# EAGLE schematic MSP-EXP432P401R (EAGLE 6.5.0)

## Sheet 1 of 7
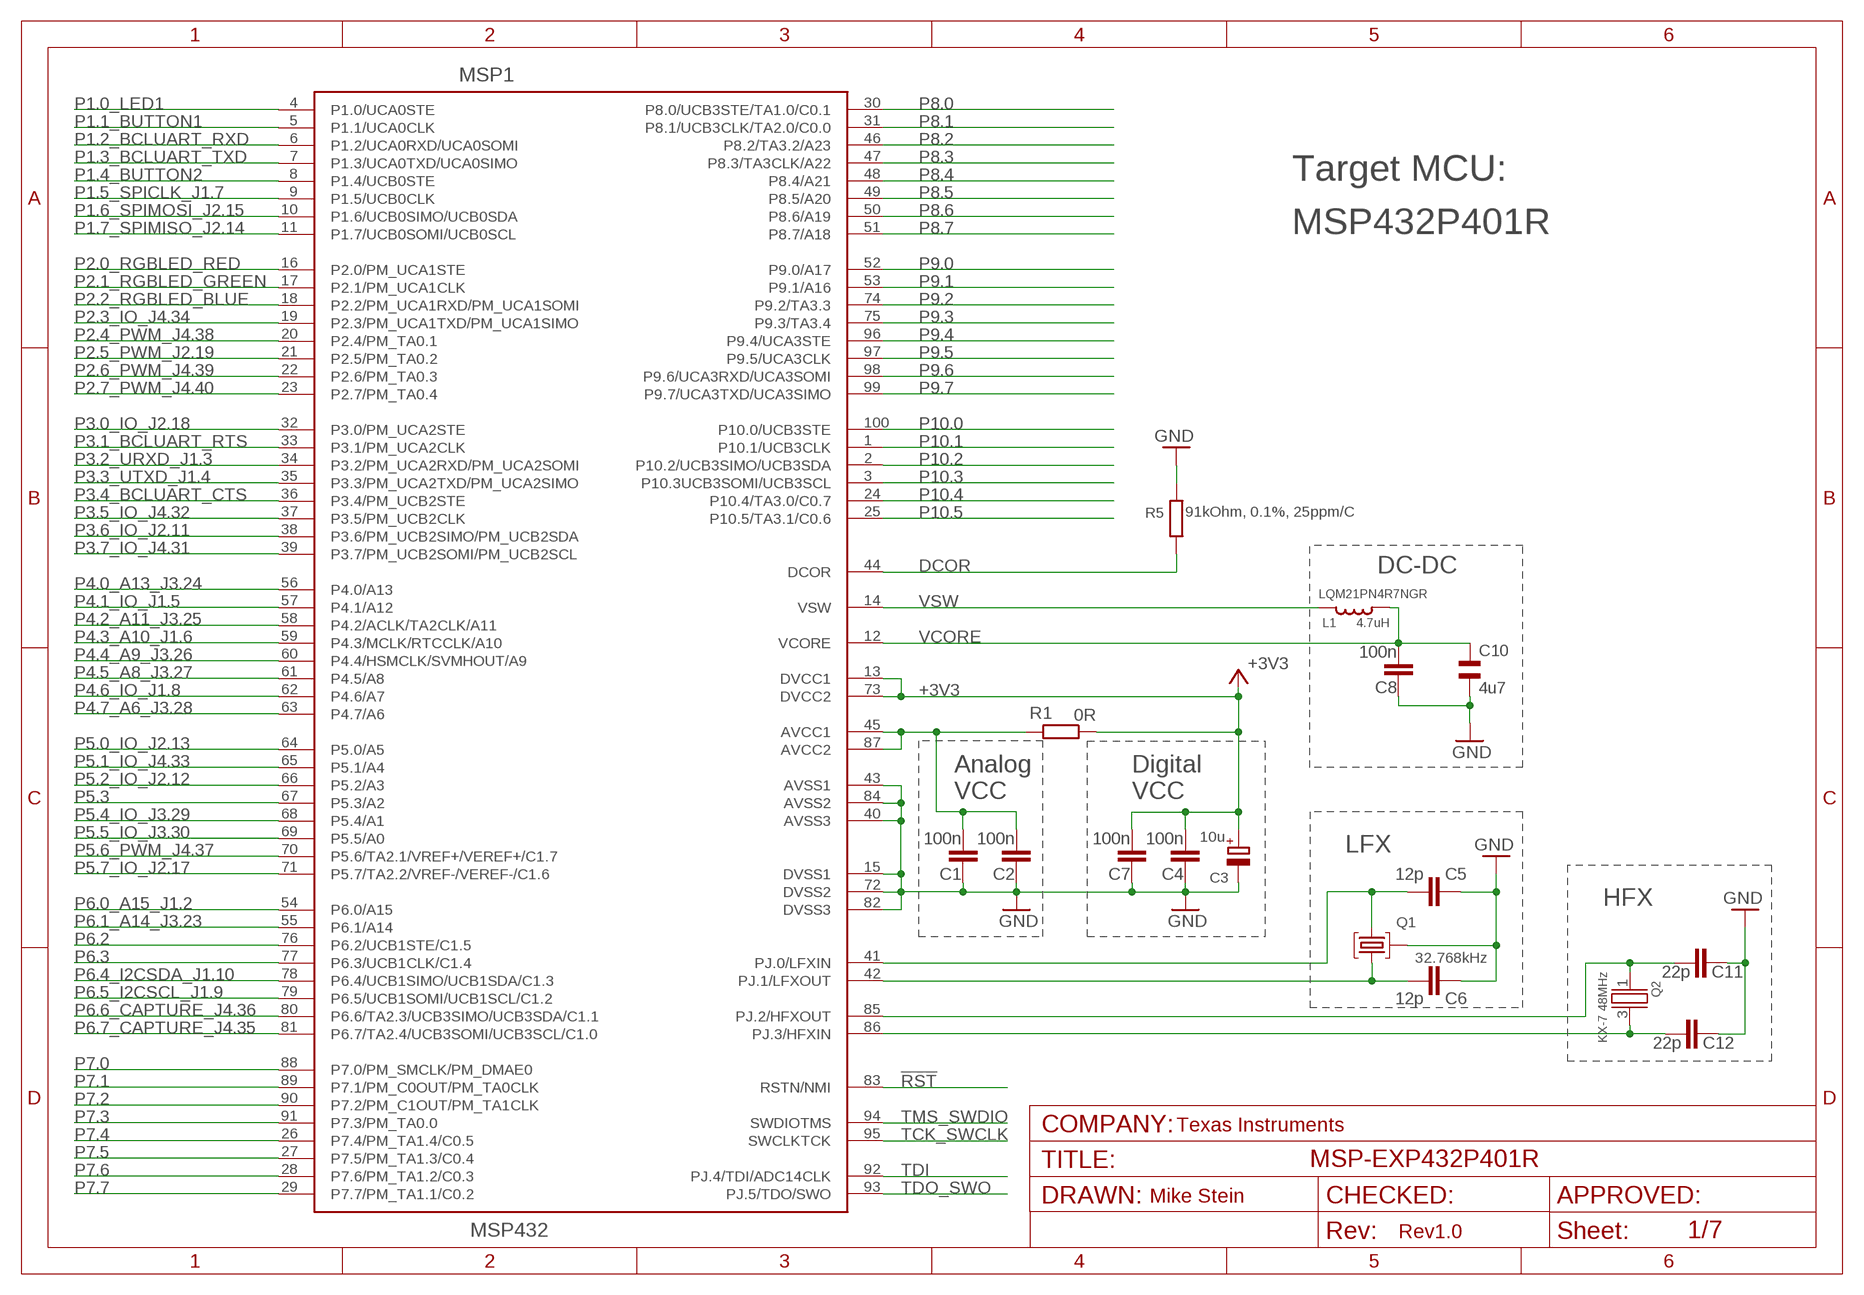
[diagram p0: schematic, sheet 1]

### Parts
C1  100n  C-EUCM0402  [0402]
C2  100n  C-EUCM0402  [0402]
C3  10u  CPOL-EUA/3216-18R  [A/3216-18R]
C4  100n  C-EUCM0402  [0402]
C5  12p  C-EUCM0402  [0402]
C6  12p  C-EUCM0402  [0402]
C7  100n  C-EUCM0402  [0402]
C8  100n  C-EUCM0402  [0402]
C10  4u7  CSMD0805  [CSMD0805]
C11  22p  C-EUCM0402  [0402]
C12  22p  C-EUCM0402  [0402]
L1  4.7uH  LQM2MP_G0  [0806]
MSP1  MSP432  [PZ100]
Q1  32.768kHz  MS3V-T1R  [MS3V-T1R]
Q2  KX-7 48MHz  KX-7  [KX-7]
R1  0R  R-EU_RM0402  [0402]
R5  91kOhm, 0.1%, 25ppm/C  R_0805  [0805]

### Nets
!RST: MSP1.83(RSTN/NMI) ; also sheet 2,3,7
+3V3: C3.+ C4.1 C7.1 MSP1.13(DVCC1) MSP1.73(DVCC2) R1.1 ; also sheet 2,3,7
DCOR: MSP1.44(DCOR) R5.1
GND: C1.2 C2.2 C3.- C4.2 C5.2 C6.2 C7.2 C8.2 C10.2 C11.2 C12.2 MSP1.15(DVSS1) MSP1.40(AVSS3) MSP1.43(AVSS1) MSP1.72(DVSS2) MSP1.82(DVSS3) MSP1.84(AVSS2) Q1.P3(GND) R5.2 ; also sheet 2,3,4,5,6,7
N$6: C1.1 C2.1 MSP1.45(AVCC1) MSP1.87(AVCC2) R1.2
N$34: C6.1 MSP1.42(PJ.1/LFXOUT) Q1.P1
N$38: C5.1 MSP1.41(PJ.0/LFXIN) Q1.P2
P1.0_LED1: MSP1.4(P1.0/UCA0STE) ; also sheet 2
P1.1_BUTTON1: MSP1.5(P1.1/UCA0CLK) ; also sheet 2
P1.2_BCLUART_RXD: MSP1.6(P1.2/UCA0RXD/UCA0SOMI) ; also sheet 3
P1.3_BCLUART_TXD: MSP1.7(P1.3/UCA0TXD/UCA0SIMO) ; also sheet 3
P1.4_BUTTON2: MSP1.8(P1.4/UCB0STE) ; also sheet 2
P1.5_SPICLK_J1.7: MSP1.9(P1.5/UCB0CLK) ; also sheet 3
P1.6_SPIMOSI_J2.15: MSP1.10(P1.6/UCB0SIMO/UCB0SDA) ; also sheet 3
P1.7_SPIMISO_J2.14: MSP1.11(P1.7/UCB0SOMI/UCB0SCL) ; also sheet 3
P2.0_RGBLED_RED: MSP1.16(P2.0/PM_UCA1STE) ; also sheet 2
P2.1_RGBLED_GREEN: MSP1.17(P2.1/PM_UCA1CLK) ; also sheet 2
P2.2_RGBLED_BLUE: MSP1.18(P2.2/PM_UCA1RXD/PM_UCA1SOMI) ; also sheet 2
P2.3_IO_J4.34: MSP1.19(P2.3/PM_UCA1TXD/PM_UCA1SIMO) ; also sheet 3
P2.4_PWM_J4.38: MSP1.20(P2.4/PM_TA0.1) ; also sheet 3
P2.5_PWM_J2.19: MSP1.21(P2.5/PM_TA0.2) ; also sheet 3
P2.6_PWM_J4.39: MSP1.22(P2.6/PM_TA0.3) ; also sheet 3
P2.7_PWM_J4.40: MSP1.23(P2.7/PM_TA0.4) ; also sheet 3
P3.0_IO_J2.18: MSP1.32(P3.0/PM_UCA2STE) ; also sheet 3
P3.1_BCLUART_RTS: MSP1.33(P3.1/PM_UCA2CLK) ; also sheet 3
P3.2_URXD_J1.3: MSP1.34(P3.2/PM_UCA2RXD/PM_UCA2SOMI) ; also sheet 3
P3.3_UTXD_J1.4: MSP1.35(P3.3/PM_UCA2TXD/PM_UCA2SIMO) ; also sheet 3
P3.4_BCLUART_CTS: MSP1.36(P3.4/PM_UCB2STE) ; also sheet 3
P3.5_IO_J4.32: MSP1.37(P3.5/PM_UCB2CLK) ; also sheet 3
P3.6_IO_J2.11: MSP1.38(P3.6/PM_UCB2SIMO/PM_UCB2SDA) ; also sheet 3
P3.7_IO_J4.31: MSP1.39(P3.7/PM_UCB2SOMI/PM_UCB2SCL) ; also sheet 3
P4.0_A13_J3.24: MSP1.56(P4.0/A13) ; also sheet 3
P4.1_IO_J1.5: MSP1.57(P4.1/A12) ; also sheet 3
P4.2_A11_J3.25: MSP1.58(P4.2/ACLK/TA2CLK/A11) ; also sheet 3
P4.3_A10_J1.6: MSP1.59(P4.3/MCLK/RTCCLK/A10) ; also sheet 3
P4.4_A9_J3.26: MSP1.60(P4.4/HSMCLK/SVMHOUT/A9) ; also sheet 3
P4.5_A8_J3.27: MSP1.61(P4.5/A8) ; also sheet 3
P4.6_IO_J1.8: MSP1.62(P4.6/A7) ; also sheet 3
P4.7_A6_J3.28: MSP1.63(P4.7/A6) ; also sheet 3
P5.0_IO_J2.13: MSP1.64(P5.0/A5) ; also sheet 3
P5.1_IO_J4.33: MSP1.65(P5.1/A4) ; also sheet 3
P5.2/XT2IN: C12.1 MSP1.86(PJ.3/HFXIN) Q2.3
P5.2_IO_J2.12: MSP1.66(P5.2/A3) ; also sheet 3
P5.3: MSP1.67(P5.3/A2) ; also sheet 3
P5.3/XT2OUT: C11.1 MSP1.85(PJ.2/HFXOUT) Q2.1
P5.4_IO_J3.29: MSP1.68(P5.4/A1) ; also sheet 3
P5.5_IO_J3.30: MSP1.69(P5.5/A0) ; also sheet 3
P5.6_PWM_J4.37: MSP1.70(P5.6/TA2.1/VREF+/VEREF+/C1.7) ; also sheet 3
P5.7_IO_J2.17: MSP1.71(P5.7/TA2.2/VREF-/VEREF-/C1.6) ; also sheet 3
P6.0_A15_J1.2: MSP1.54(P6.0/A15) ; also sheet 3
P6.1_A14_J3.23: MSP1.55(P6.1/A14) ; also sheet 3
P6.2: MSP1.76(P6.2/UCB1STE/C1.5) ; also sheet 3
P6.3: MSP1.77(P6.3/UCB1CLK/C1.4) ; also sheet 3
P6.4_I2CSDA_J1.10: MSP1.78(P6.4/UCB1SIMO/UCB1SDA/C1.3) ; also sheet 3
P6.5_I2CSCL_J1.9: MSP1.79(P6.5/UCB1SOMI/UCB1SCL/C1.2) ; also sheet 3
P6.6_CAPTURE_J4.36: MSP1.80(P6.6/TA2.3/UCB3SIMO/UCB3SDA/C1.1) ; also sheet 3
P6.7_CAPTURE_J4.35: MSP1.81(P6.7/TA2.4/UCB3SOMI/UCB3SCL/C1.0) ; also sheet 3
P7.0: MSP1.88(P7.0/PM_SMCLK/PM_DMAE0) ; also sheet 3
P7.1: MSP1.89(P7.1/PM_C0OUT/PM_TA0CLK) ; also sheet 3
P7.2: MSP1.90(P7.2/PM_C1OUT/PM_TA1CLK) ; also sheet 3
P7.3: MSP1.91(P7.3/PM_TA0.0) ; also sheet 3
P7.4: MSP1.26(P7.4/PM_TA1.4/C0.5) ; also sheet 3
P7.5: MSP1.27(P7.5/PM_TA1.3/C0.4) ; also sheet 3
P7.6: MSP1.28(P7.6/PM_TA1.2/C0.3) ; also sheet 3
P7.7: MSP1.29(P7.7/PM_TA1.1/C0.2) ; also sheet 3
P8.0: MSP1.30(P8.0/UCB3STE/TA1.0/C0.1) ; also sheet 3
P8.1: MSP1.31(P8.1/UCB3CLK/TA2.0/C0.0)
P8.2: MSP1.46(P8.2/TA3.2/A23) ; also sheet 3
P8.3: MSP1.47(P8.3/TA3CLK/A22) ; also sheet 3
P8.4: MSP1.48(P8.4/A21) ; also sheet 3
P8.5: MSP1.49(P8.5/A20) ; also sheet 3
P8.6: MSP1.50(P8.6/A19) ; also sheet 3
P8.7: MSP1.51(P8.7/A18) ; also sheet 3
P9.0: MSP1.52(P9.0/A17) ; also sheet 3
P9.1: MSP1.53(P9.1/A16) ; also sheet 3
P9.2: MSP1.74(P9.2/TA3.3) ; also sheet 3
P9.3: MSP1.75(P9.3/TA3.4) ; also sheet 3
P9.4: MSP1.96(P9.4/UCA3STE) ; also sheet 3
P9.5: MSP1.97(P9.5/UCA3CLK) ; also sheet 3
P9.6: MSP1.98(P9.6/UCA3RXD/UCA3SOMI) ; also sheet 3
P9.7: MSP1.99(P9.7/UCA3TXD/UCA3SIMO) ; also sheet 3
P10.0: MSP1.100(P10.0/UCB3STE) ; also sheet 3
P10.1: MSP1.1(P10.1/UCB3CLK) ; also sheet 3
P10.2: MSP1.2(P10.2/UCB3SIMO/UCB3SDA) ; also sheet 3
P10.3: MSP1.3(P10.3UCB3SOMI/UCB3SCL) ; also sheet 3
P10.4: MSP1.24(P10.4/TA3.0/C0.7) ; also sheet 3
P10.5: MSP1.25(P10.5/TA3.1/C0.6) ; also sheet 3
TCK_SWCLK: MSP1.95(SWCLKTCK) ; also sheet 7
TDI: MSP1.92(PJ.4/TDI/ADC14CLK) ; also sheet 7
TDO_SWO: MSP1.93(PJ.5/TDO/SWO) ; also sheet 7
TMS_SWDIO: MSP1.94(SWDIOTMS) ; also sheet 7
VCORE: C8.1 C10.1 L1.1 MSP1.12(VCORE)
VSW: L1.2 MSP1.14(VSW)

### Notes on the sheet
- Target MCU:
- MSP432P401R
- DC-DC
- LQM21PN4R7NGR
- Analog | Digital
- VCC | VCC
- LFX
- HFX
- Texas Instruments
- Mike Stein
- Rev1.0

## Sheet 2 of 7
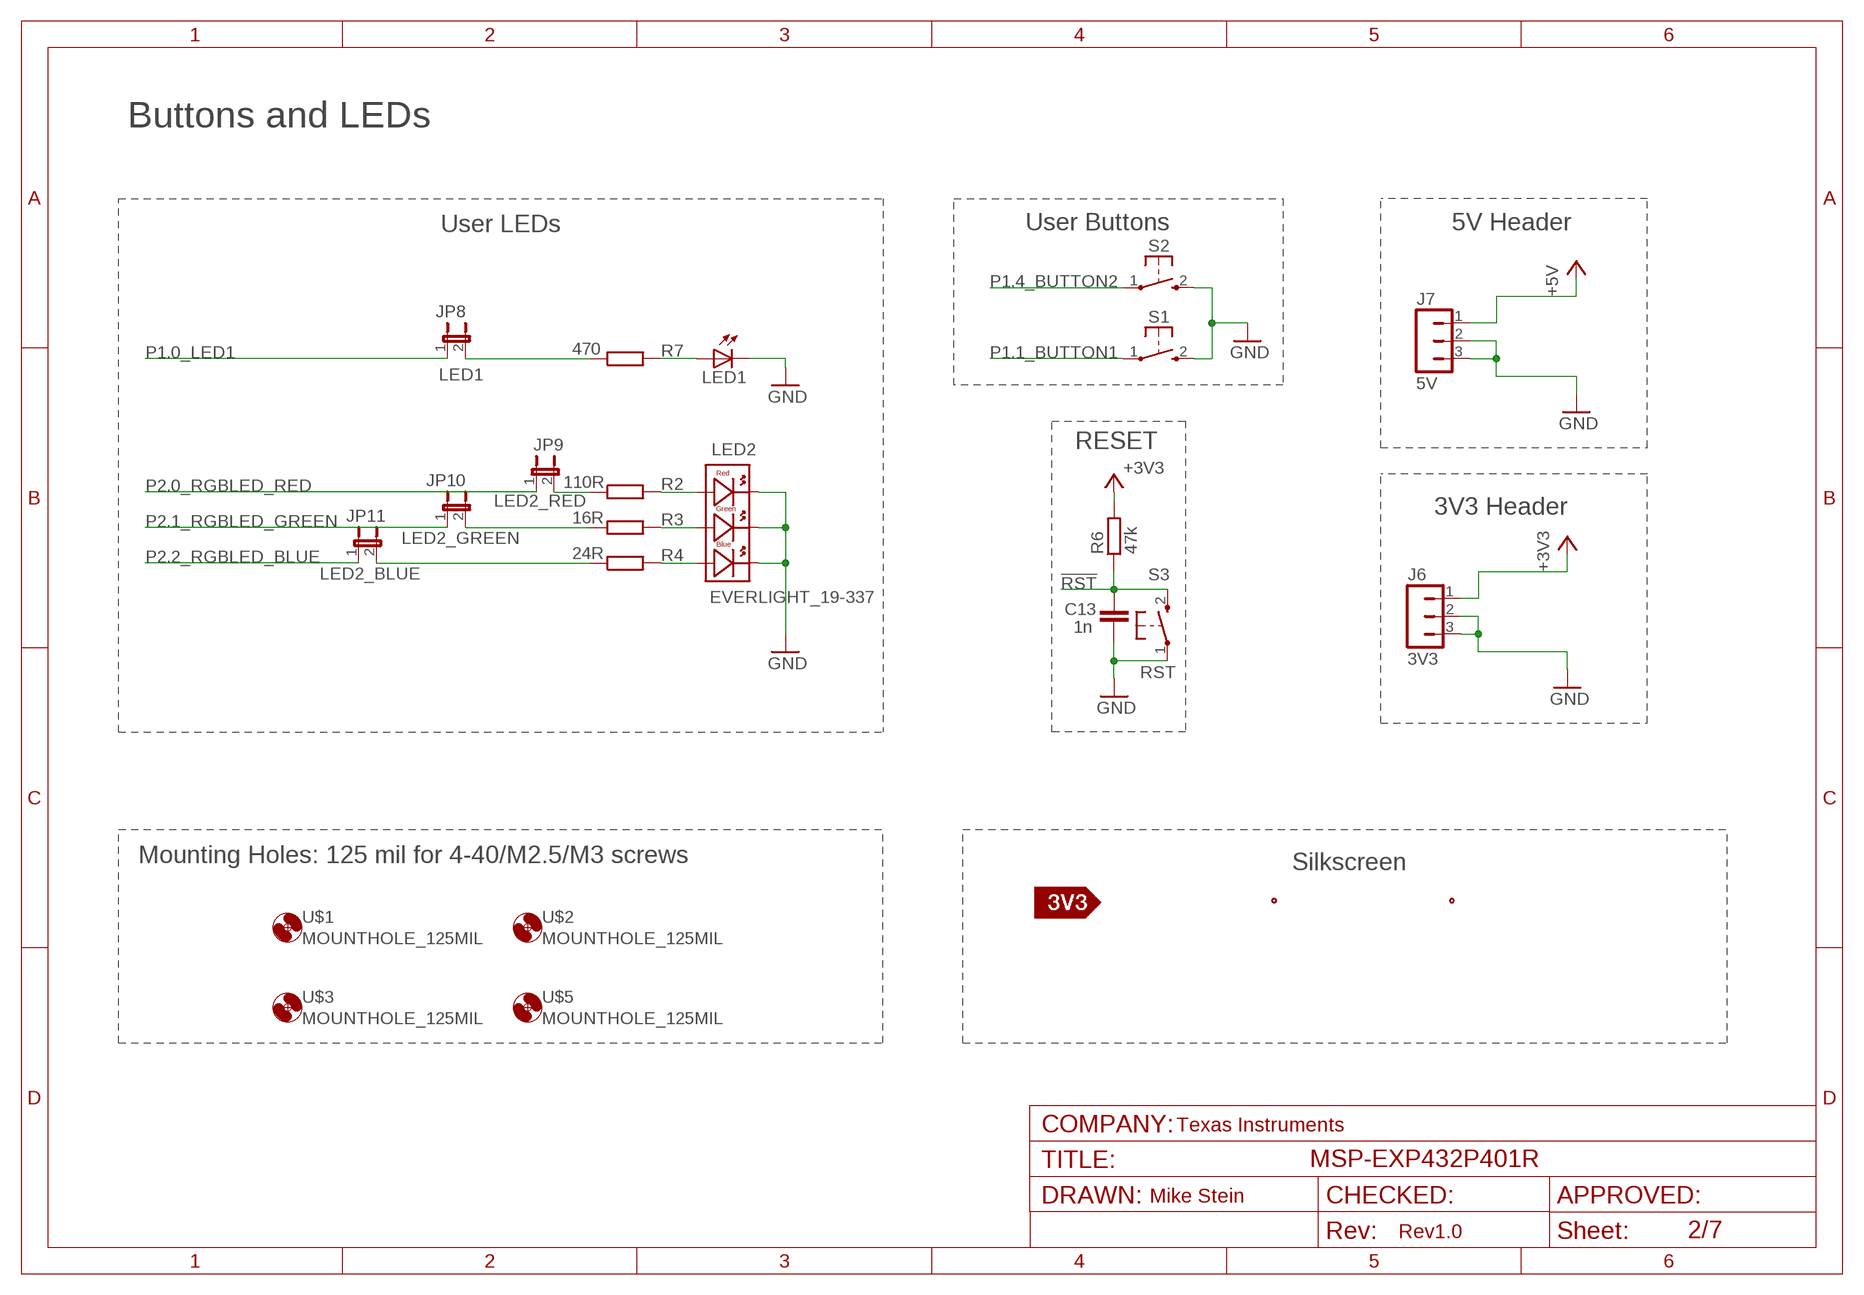
[diagram p1: schematic, sheet 2]

### Parts
C13  1n  C-EUCM0402  [0402]
J6  3V3  JP3  [JP3]
J7  5V  JP3  [JP3]
JP8  LED1  JP1M  [JP1M]
JP9  LED2_RED  JP1M  [JP1M]
JP10  LED2_GREEN  JP1M  [JP1M]
JP11  LED2_BLUE  JP1M  [JP1M]
LED1  LEDCHIPLED_0603  [CHIPLED_0603]
LED2  EVERLIGHT_19-337  [RGB_LED]
R2  110R  R-EU_RM0402  [0402]
R3  16R  R-EU_RM0402  [0402]
R4  24R  R-EU_RM0402  [0402]
R6  47k  R-EU_RM0402  [0402]
R7  470  R-EU_RM0402  [0402]
S1  PB  [PBTH]
S2  PB  [PBTH]
S3  RST  PB  [PBTH]
U$1  MOUNTHOLE_125MIL  [MOUNTHOLE_125MIL]
U$2  MOUNTHOLE_125MIL  [MOUNTHOLE_125MIL]
U$3  MOUNTHOLE_125MIL  [MOUNTHOLE_125MIL]
U$5  MOUNTHOLE_125MIL  [MOUNTHOLE_125MIL]
U$6  SILK_HEADER_LABEL  [SILK_HEADER_LABEL]
U$7  SILK_3V3_TAG  [SILK_3V3_TAG]
U$8  SILK_P401R_REAR  [SILK_P401R_REAR]

### Nets
!RST: C13.1 R6.1 S3.2(S) ; also sheet 1,3,7
+3V3: J6.1 R6.2 ; also sheet 1,3,7
+5V [Power]: J7.1 ; also sheet 3
GND: C13.2 J6.2 J6.3 J7.2 J7.3 LED1.C LED2.1(BC) LED2.2(RC) LED2.3(GC) S1.2(S) S2.2(S) S3.1(P) ; also sheet 1,3,4,5,6,7
N$8: JP9.2 R2.1
N$9: LED2.5(RA) R2.2
N$10: LED2.6(GA) R3.2
N$11: LED2.4(BA) R4.2
N$17: LED1.A R7.2
N$19: JP10.2 R3.1
N$25: JP11.2 R4.1
N$29: JP8.2 R7.1
P1.0_LED1: JP8.1 ; also sheet 1
P1.1_BUTTON1: S1.1(P) ; also sheet 1
P1.4_BUTTON2: S2.1(P) ; also sheet 1
P2.0_RGBLED_RED: JP9.1 ; also sheet 1
P2.1_RGBLED_GREEN: JP10.1 ; also sheet 1
P2.2_RGBLED_BLUE: JP11.1 ; also sheet 1

### Notes on the sheet
- Buttons and LEDs
- User LEDs | User Buttons | 5V Header
- RESET
- 3V3 Header
- Mounting Holes: 125 mil for 4-40/M2.5/M3 screws | Silkscreen
- Texas Instruments
- Mike Stein
- Rev1.0

## Sheet 3 of 7
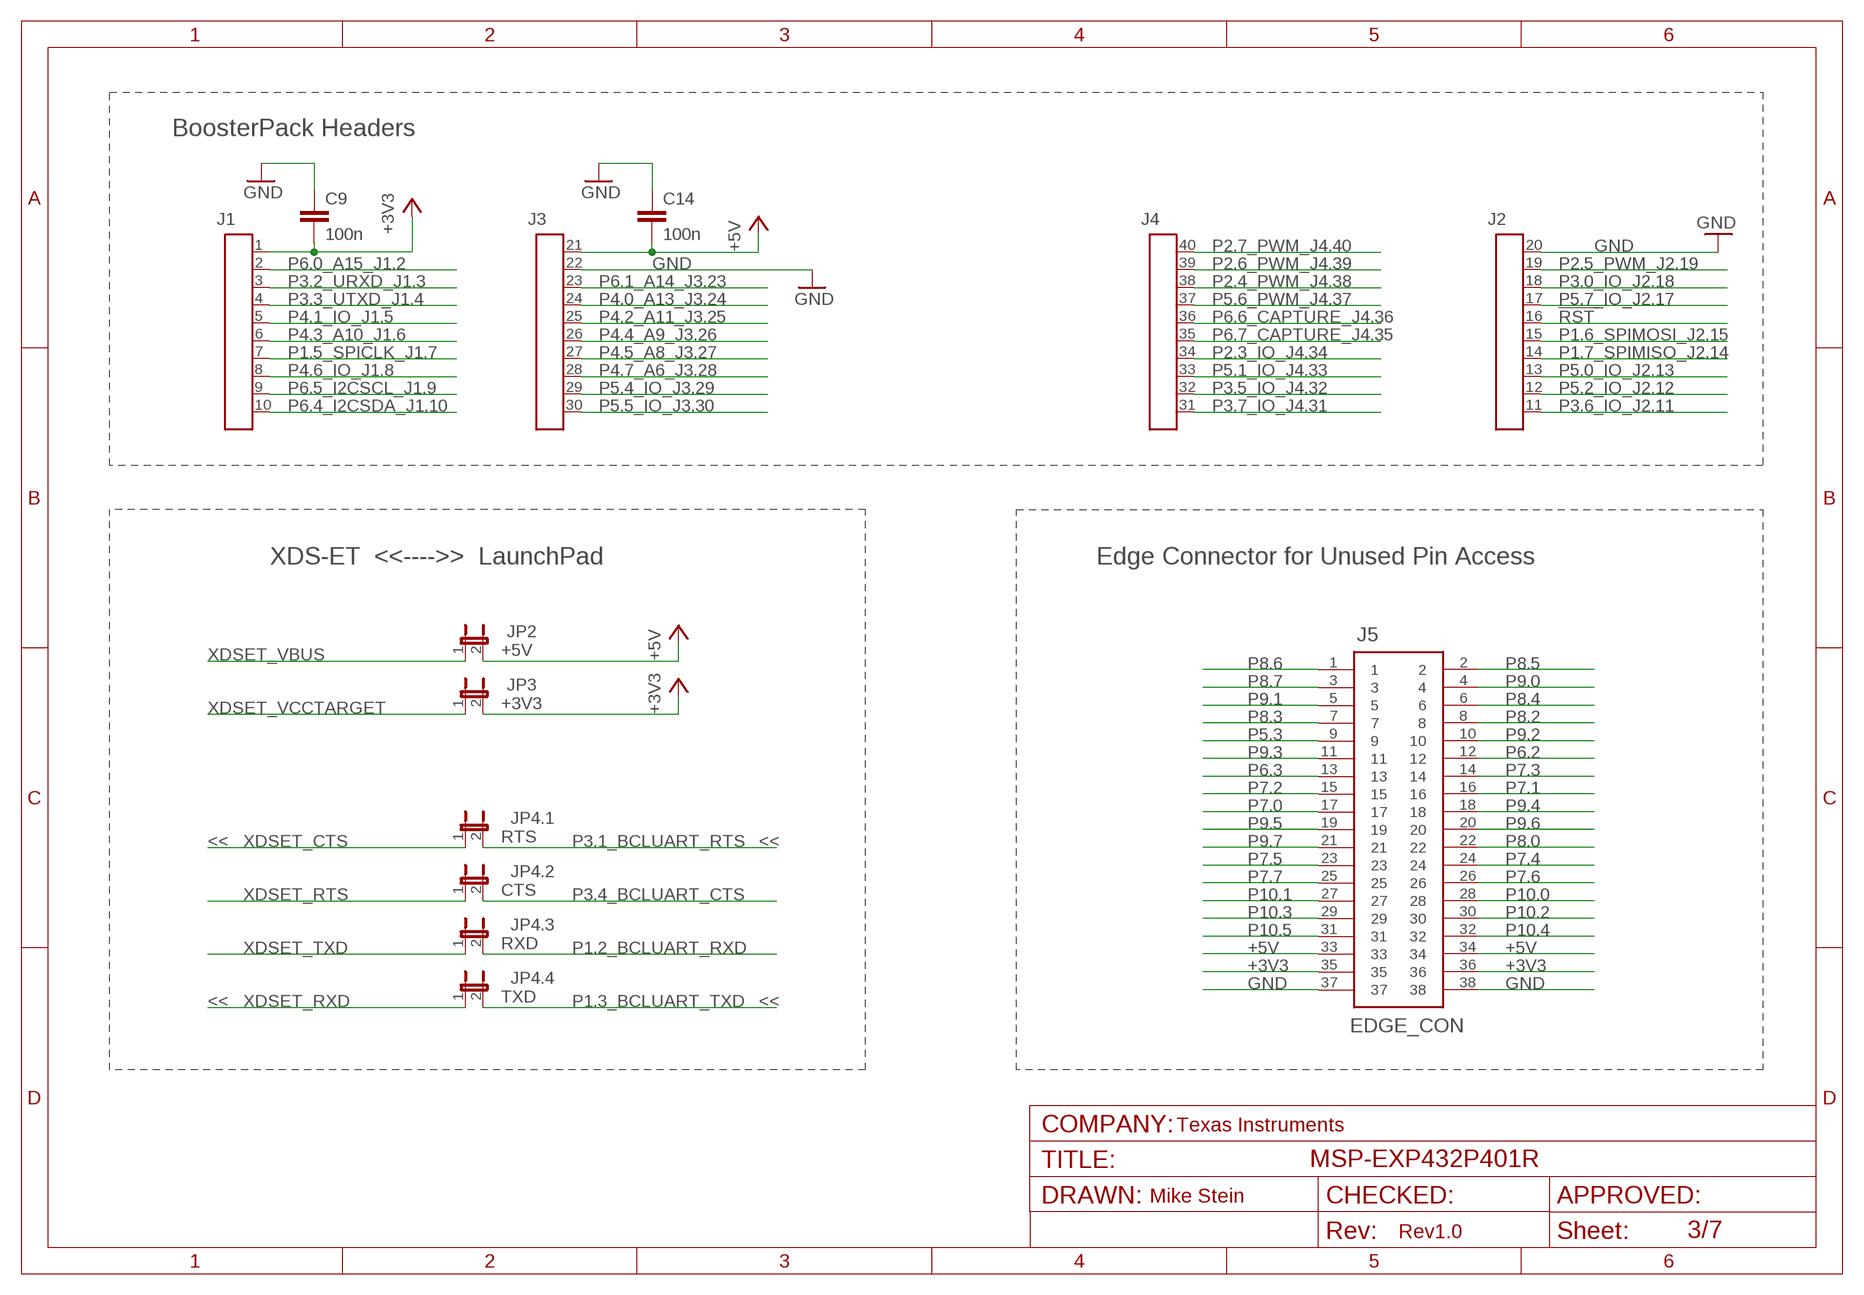
[diagram p2: schematic, sheet 3]

### Parts
C9  100n  C-EUCM0402  [0402]
C14  100n  C-EUCM0402  [0402]
J1  HEADER1X10  [1X10]
J2  HEADER1X10-J2  [1X10-J2]
J3  HEADER1X10-J3  [1X10-J3]
J4  HEADER1X10-J4  [1X10-J4]
J5  EDGE_CON  [BOTTOM_CONNECTOR]
JP2  +5V  JP1M  [JP1M]
JP3  +3V3  JP1M  [JP1M]
JP4.1  RTS  JP1M  [JP1M]
JP4.2  CTS  JP1M  [JP1M]
JP4.3  RXD  JP1M  [JP1M]
JP4.4  TXD  JP1M  [JP1M]

### Nets
!RST: J2.16 ; also sheet 1,2,7
+3V3: C9.2 J1.1 J5.35 J5.36 JP3.2 ; also sheet 1,2,7
+5V [Power]: C14.2 J3.21 J5.33 J5.34 JP2.2 ; also sheet 2
GND: C9.1 C14.1 J2.20 J3.22 J5.37 J5.38 ; also sheet 1,2,4,5,6,7
P1.2_BCLUART_RXD: JP4.3.2 ; also sheet 1
P1.3_BCLUART_TXD: JP4.4.2 ; also sheet 1
P1.5_SPICLK_J1.7: J1.7 ; also sheet 1
P1.6_SPIMOSI_J2.15: J2.15 ; also sheet 1
P1.7_SPIMISO_J2.14: J2.14 ; also sheet 1
P2.3_IO_J4.34: J4.34 ; also sheet 1
P2.4_PWM_J4.38: J4.38 ; also sheet 1
P2.5_PWM_J2.19: J2.19 ; also sheet 1
P2.6_PWM_J4.39: J4.39 ; also sheet 1
P2.7_PWM_J4.40: J4.40 ; also sheet 1
P3.0_IO_J2.18: J2.18 ; also sheet 1
P3.1_BCLUART_RTS: JP4.1.2 ; also sheet 1
P3.2_URXD_J1.3: J1.3 ; also sheet 1
P3.3_UTXD_J1.4: J1.4 ; also sheet 1
P3.4_BCLUART_CTS: JP4.2.2 ; also sheet 1
P3.5_IO_J4.32: J4.32 ; also sheet 1
P3.6_IO_J2.11: J2.11 ; also sheet 1
P3.7_IO_J4.31: J4.31 ; also sheet 1
P4.0_A13_J3.24: J3.24 ; also sheet 1
P4.1_IO_J1.5: J1.5 ; also sheet 1
P4.2_A11_J3.25: J3.25 ; also sheet 1
P4.3_A10_J1.6: J1.6 ; also sheet 1
P4.4_A9_J3.26: J3.26 ; also sheet 1
P4.5_A8_J3.27: J3.27 ; also sheet 1
P4.6_IO_J1.8: J1.8 ; also sheet 1
P4.7_A6_J3.28: J3.28 ; also sheet 1
P5.0_IO_J2.13: J2.13 ; also sheet 1
P5.1_IO_J4.33: J4.33 ; also sheet 1
P5.2_IO_J2.12: J2.12 ; also sheet 1
P5.3: J5.9 ; also sheet 1
P5.4_IO_J3.29: J3.29 ; also sheet 1
P5.5_IO_J3.30: J3.30 ; also sheet 1
P5.6_PWM_J4.37: J4.37 ; also sheet 1
P5.7_IO_J2.17: J2.17 ; also sheet 1
P6.0_A15_J1.2: J1.2 ; also sheet 1
P6.1_A14_J3.23: J3.23 ; also sheet 1
P6.2: J5.12 ; also sheet 1
P6.3: J5.13 ; also sheet 1
P6.4_I2CSDA_J1.10: J1.10 ; also sheet 1
P6.5_I2CSCL_J1.9: J1.9 ; also sheet 1
P6.6_CAPTURE_J4.36: J4.36 ; also sheet 1
P6.7_CAPTURE_J4.35: J4.35 ; also sheet 1
P7.0: J5.17 ; also sheet 1
P7.1: J5.16 ; also sheet 1
P7.2: J5.15 ; also sheet 1
P7.3: J5.14 ; also sheet 1
P7.4: J5.24 ; also sheet 1
P7.5: J5.23 ; also sheet 1
P7.6: J5.26 ; also sheet 1
P7.7: J5.25 ; also sheet 1
P8.0: J5.22 ; also sheet 1
P8.2: J5.8 ; also sheet 1
P8.3: J5.7 ; also sheet 1
P8.4: J5.6 ; also sheet 1
P8.5: J5.2 ; also sheet 1
P8.6: J5.1 ; also sheet 1
P8.7: J5.3 ; also sheet 1
P9.0: J5.4 ; also sheet 1
P9.1: J5.5 ; also sheet 1
P9.2: J5.10 ; also sheet 1
P9.3: J5.11 ; also sheet 1
P9.4: J5.18 ; also sheet 1
P9.5: J5.19 ; also sheet 1
P9.6: J5.20 ; also sheet 1
P9.7: J5.21 ; also sheet 1
P10.0: J5.28 ; also sheet 1
P10.1: J5.27 ; also sheet 1
P10.2: J5.30 ; also sheet 1
P10.3: J5.29 ; also sheet 1
P10.4: J5.32 ; also sheet 1
P10.5: J5.31 ; also sheet 1
XDSET_CTS: JP4.1.1 ; also sheet 4
XDSET_RTS: JP4.2.1 ; also sheet 4
XDSET_RXD: JP4.4.1 ; also sheet 4,7
XDSET_TXD: JP4.3.1 ; also sheet 4,7
XDSET_VBUS: JP2.1 ; also sheet 4,5,6
XDSET_VCCTARGET: JP3.1 ; also sheet 5,7

### Notes on the sheet
- BoosterPack Headers
- XDS-ET  <<---->>  LaunchPad | Edge Connector for Unused Pin Access
- << | <<
- << | <<
- Texas Instruments
- Mike Stein
- Rev1.0

## Sheet 4 of 7
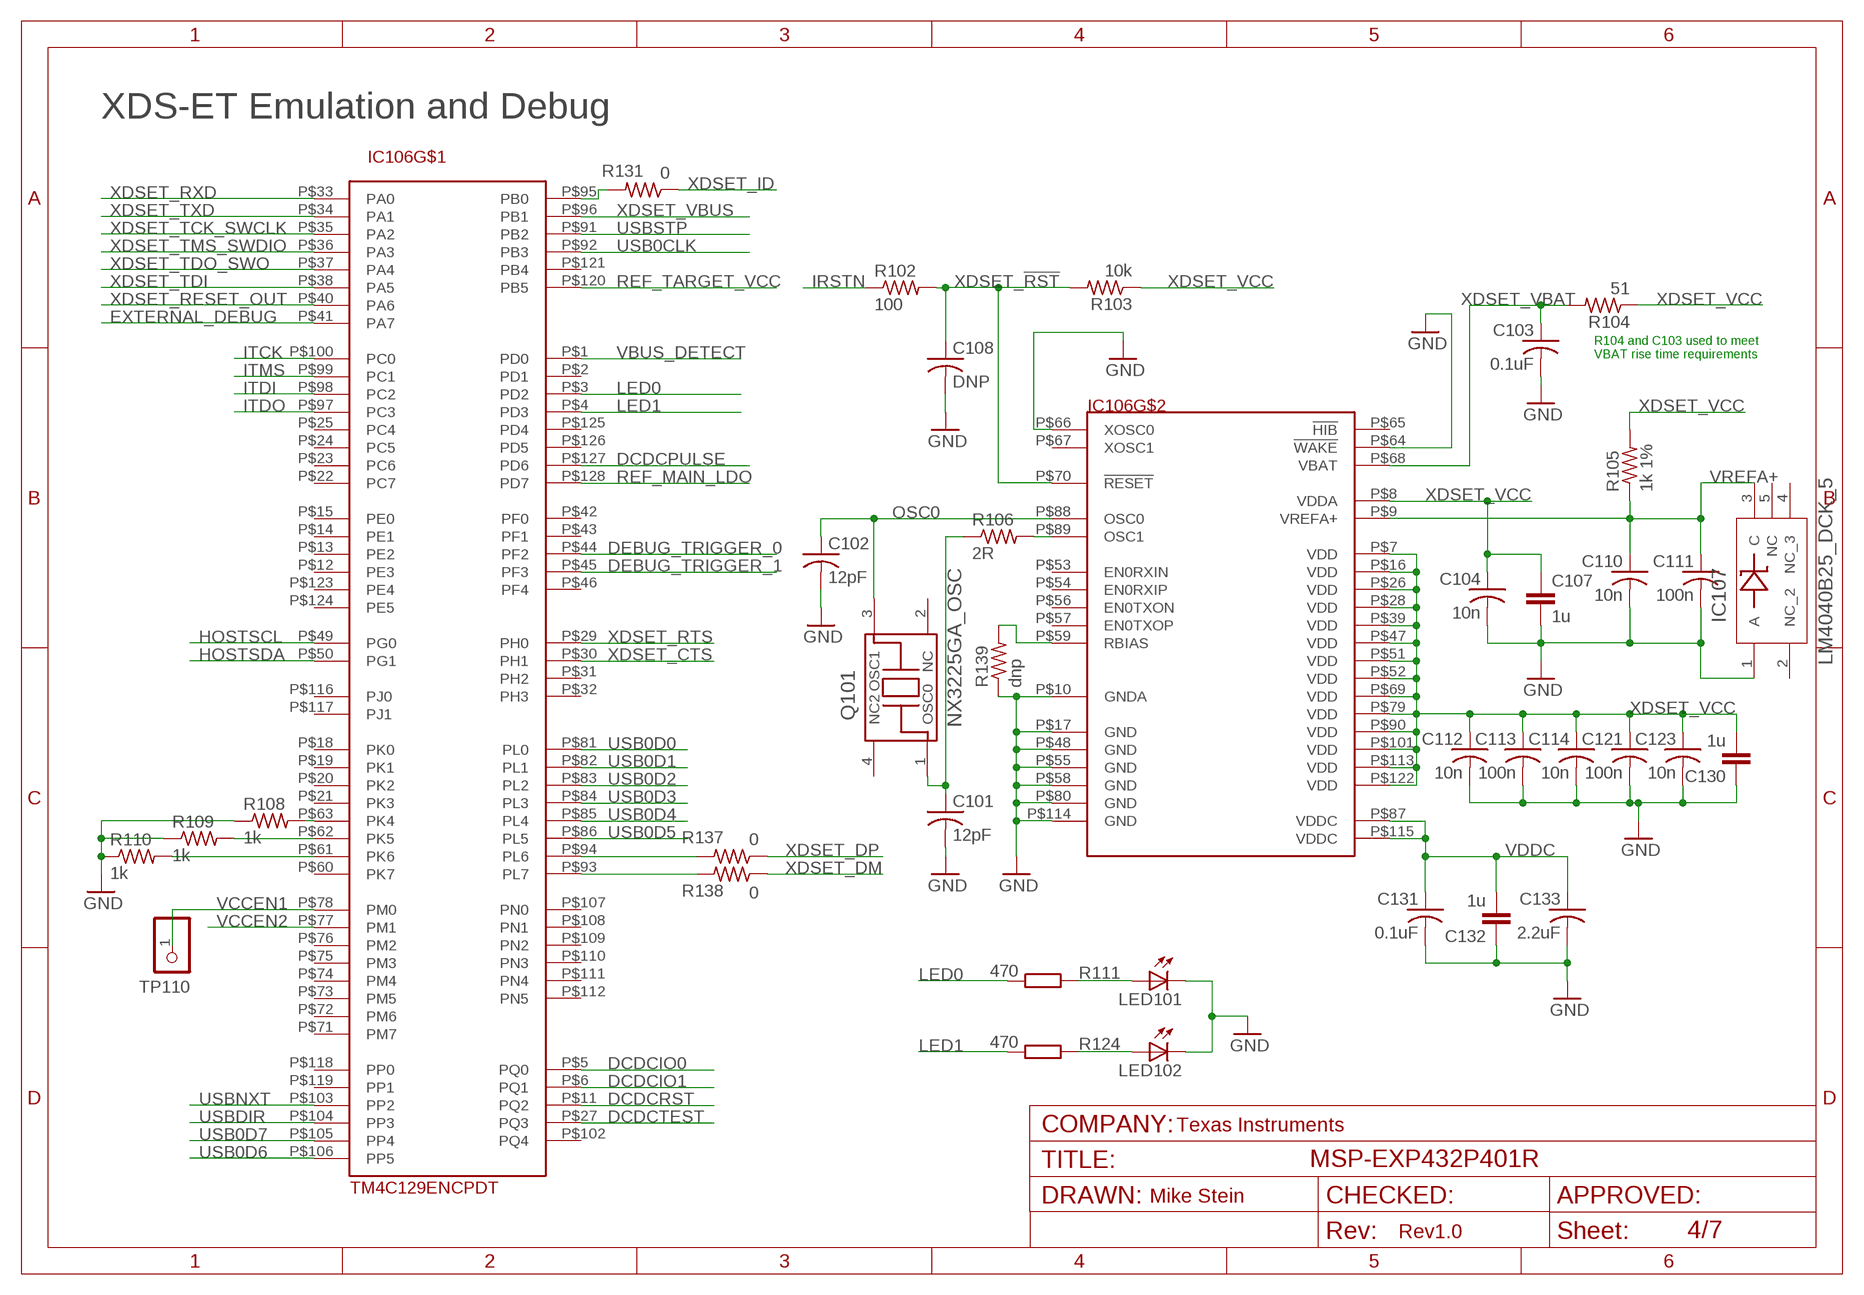
[diagram p3: schematic, sheet 4]

### Parts
C101  12pF  C-USC0402  [C0402]
C102  12pF  C-USC0402  [C0402]
C103  0.1uF  C-USC0402  [C0402]
C104  10n  C-USC0402  [C0402]
C107  1u  C-EUC0603  [C0603]
C108  DNP  C-USC0402  [C0402]
C110  10n  C-USC0402  [C0402]
C111  100n  C-USC0402  [C0402]
C112  10n  C-USC0402  [C0402]
C113  100n  C-USC0402  [C0402]
C114  10n  C-USC0402  [C0402]
C121  100n  C-USC0402  [C0402]
C123  10n  C-USC0402  [C0402]
C130  1u  C-EUC0603  [C0603]
C131  0.1uF  C-USC0402  [C0402]
C132  1u  C-EUC0603  [C0603]
C133  2.2uF  C-USC0603K  [C0603K]
IC106  TM4C129ENCPDT  [TQFP-128]
IC107  LM4040B25_DCK_5  [DCK5]
LED101  LEDCHIPLED_0603  [CHIPLED_0603]
LED102  LEDCHIPLED_0603  [CHIPLED_0603]
Q101  NX3225GA_OSC  [NX3225GA]
R102  100  R-US_R0402  [R0402]
R103  10k  R-US_R0402  [R0402]
R104  51  R-US_R0402  [R0402]
R105  1k 1%  R-US_R0402  [R0402]
R106  2R  R-US_R0402  [R0402]
R108  1k  R-US_R0402  [R0402]
R109  1k  R-US_R0402  [R0402]
R110  1k  R-US_R0402  [R0402]
R111  470  R-EU_RM0402  [0402]
R124  470  R-EU_RM0402  [0402]
R131  0  R-US_R0402  [R0402]
R137  0  R-US_R0402  [R0402]
R138  0  R-US_R0402  [R0402]
R139  dnp  R-US_R0402  [R0402]
TP110  TEST_PIN2  PINHD-1X1  [1X01]

### Nets
DCDCIO0: IC106.P$5(PQ0) ; also sheet 5
DCDCIO1: IC106.P$6(PQ1) ; also sheet 5
DCDCPULSE: IC106.P$127(PD6) ; also sheet 5
DCDCRST: IC106.P$11(PQ2) ; also sheet 5,6
DCDCTEST: IC106.P$27(PQ3) ; also sheet 5,6
DEBUG_TRIGGER_0: IC106.P$44(PF2)
DEBUG_TRIGGER_1: IC106.P$45(PF3)
EXTERNAL_DEBUG: IC106.P$41(PA7)
GND: C101.2 C102.2 C103.2 C104.2 C107.2 C108.2 C110.2 C111.2 C112.2 C113.2 C114.2 C121.2 C123.2 C130.1 C131.2 C132.1 C133.2 IC106.P$10(GNDA) IC106.P$17(GND) IC106.P$48(GND) IC106.P$55(GND) IC106.P$58(GND) IC106.P$64(!WAKE) IC106.P$66(XOSC0) IC106.P$80(GND) IC106.P$114(GND) IC107.1(A) LED101.C LED102.C R108.1 R109.1 R110.1 R139.1 ; also sheet 1,2,3,5,6,7
HOSTSCL: IC106.P$49(PG0) ; also sheet 5
HOSTSDA: IC106.P$50(PG1) ; also sheet 5
IRSTN: R102.1 ; also sheet 6
ITCK: IC106.P$100(PC0) ; also sheet 6
ITDI: IC106.P$98(PC2) ; also sheet 6
ITDO: IC106.P$97(PC3) ; also sheet 6
ITMS: IC106.P$99(PC1) ; also sheet 6
LED0: IC106.P$3(PD2) R111.1
LED1: IC106.P$4(PD3) R124.1
N$3: IC106.P$63(PK4) R108.2
N$4: LED102.A R124.2
N$7: LED101.A R111.2
N$21: IC106.P$93(PL7) R138.2
N$22: IC106.P$61(PK6) R110.2
N$23: IC106.P$95(PB0) R131.2
N$27: IC106.P$62(PK5) R109.2
N$47: IC106.P$59(RBIAS) R139.2
OSC0: C102.1 IC106.P$88(OSC0) Q101.3(OSC1)
OSC1: IC106.P$89(OSC1) R106.2
OSC1_R: C101.1 Q101.1(OSC0) R106.1
REF_MAIN_LDO: IC106.P$128(PD7) ; also sheet 5
REF_TARGET_VCC: IC106.P$120(PB5) ; also sheet 5
USB0CLK: IC106.P$92(PB3) ; also sheet 7
USB0D0: IC106.P$81(PL0) ; also sheet 7
USB0D1: IC106.P$82(PL1) ; also sheet 7
USB0D2: IC106.P$83(PL2) ; also sheet 7
USB0D3: IC106.P$84(PL3) ; also sheet 7
USB0D4: IC106.P$85(PL4) ; also sheet 7
USB0D5: IC106.P$86(PL5) ; also sheet 7
USB0D6: IC106.P$106(PP5) ; also sheet 7
USB0D7: IC106.P$105(PP4) ; also sheet 7
USBDIR: IC106.P$104(PP3) ; also sheet 7
USBNXT: IC106.P$103(PP2) ; also sheet 7
USBSTP: IC106.P$91(PB2) ; also sheet 7
VBUS_DETECT: IC106.P$1(PD0) ; also sheet 6
VCCEN1: IC106.P$78(PM0) TP110.1 ; also sheet 5
VCCEN2: IC106.P$77(PM1)
VDDC: C131.1 C132.2 C133.1 IC106.P$87(VDDC) IC106.P$115(VDDC)
VREFA+: C110.1 C111.1 IC106.P$9(VREFA+) IC107.3(C) R105.1
XDSET_!RST: C108.1 IC106.P$70(!RESET) R102.2 R103.2
XDSET_CTS: IC106.P$30(PH1) ; also sheet 3
XDSET_DM: R138.1 ; also sheet 6
XDSET_DP: R137.1 ; also sheet 6
XDSET_DPR: IC106.P$94(PL6) R137.2
XDSET_ID: R131.1 ; also sheet 6
XDSET_RESET_OUT: IC106.P$40(PA6) ; also sheet 7
XDSET_RTS: IC106.P$29(PH0) ; also sheet 3
XDSET_RXD: IC106.P$33(PA0) ; also sheet 3,7
XDSET_TCK_SWCLK: IC106.P$35(PA2) ; also sheet 7
XDSET_TDI: IC106.P$38(PA5) ; also sheet 7
XDSET_TDO_SWO: IC106.P$37(PA4) ; also sheet 7
XDSET_TMS_SWDIO: IC106.P$36(PA3) ; also sheet 7
XDSET_TXD: IC106.P$34(PA1) ; also sheet 3,7
XDSET_VBAT: C103.1 IC106.P$68(VBAT) R104.2
XDSET_VBUS: IC106.P$96(PB1) ; also sheet 3,5,6
XDSET_VCC: C104.1 C107.1 C112.1 C113.1 C114.1 C121.1 C123.1 C130.2 IC106.P$7(VDD) IC106.P$8(VDDA) IC106.P$16(VDD) IC106.P$26(VDD) IC106.P$28(VDD) IC106.P$39(VDD) IC106.P$47(VDD) IC106.P$51(VDD) IC106.P$52(VDD) IC106.P$69(VDD) IC106.P$79(VDD) IC106.P$90(VDD) IC106.P$101(VDD) IC106.P$113(VDD) IC106.P$122(VDD) R103.1 R104.1 R105.2 ; also sheet 5,6,7
Unconnected: IC106.P$2(PD1) IC106.P$12(PE3) IC106.P$13(PE2) IC106.P$14(PE1) IC106.P$15(PE0) IC106.P$18(PK0) IC106.P$19(PK1) IC106.P$20(PK2) IC106.P$21(PK3) IC106.P$22(PC7) IC106.P$23(PC6) IC106.P$24(PC5) IC106.P$25(PC4) IC106.P$31(PH2) IC106.P$32(PH3) IC106.P$42(PF0) IC106.P$43(PF1) IC106.P$46(PF4) IC106.P$53(EN0RXIN) IC106.P$54(EN0RXIP) IC106.P$56(EN0TXON) IC106.P$57(EN0TXOP) IC106.P$60(PK7) IC106.P$65(!HIB) IC106.P$67(XOSC1) IC106.P$71(PM7) IC106.P$72(PM6) IC106.P$73(PM5) IC106.P$74(PM4) IC106.P$75(PM3) IC106.P$76(PM2) IC106.P$102(PQ4) IC106.P$107(PN0) IC106.P$108(PN1) IC106.P$109(PN2) IC106.P$110(PN3) IC106.P$111(PN4) IC106.P$112(PN5) IC106.P$116(PJ0) IC106.P$117(PJ1) IC106.P$118(PP0) IC106.P$119(PP1) IC106.P$121(PB4) IC106.P$123(PE4) IC106.P$124(PE5) IC106.P$125(PD4) IC106.P$126(PD5) IC107.2(NC_2) IC107.4(NC_3) IC107.5(NC) Q101.2(NC) Q101.4(NC2)

### Notes on the sheet
- XDS-ET Emulation and Debug
- R104 and C103 used to meet 
  VBAT rise time requirements
- Texas Instruments
- Mike Stein
- Rev1.0

## Sheet 5 of 7
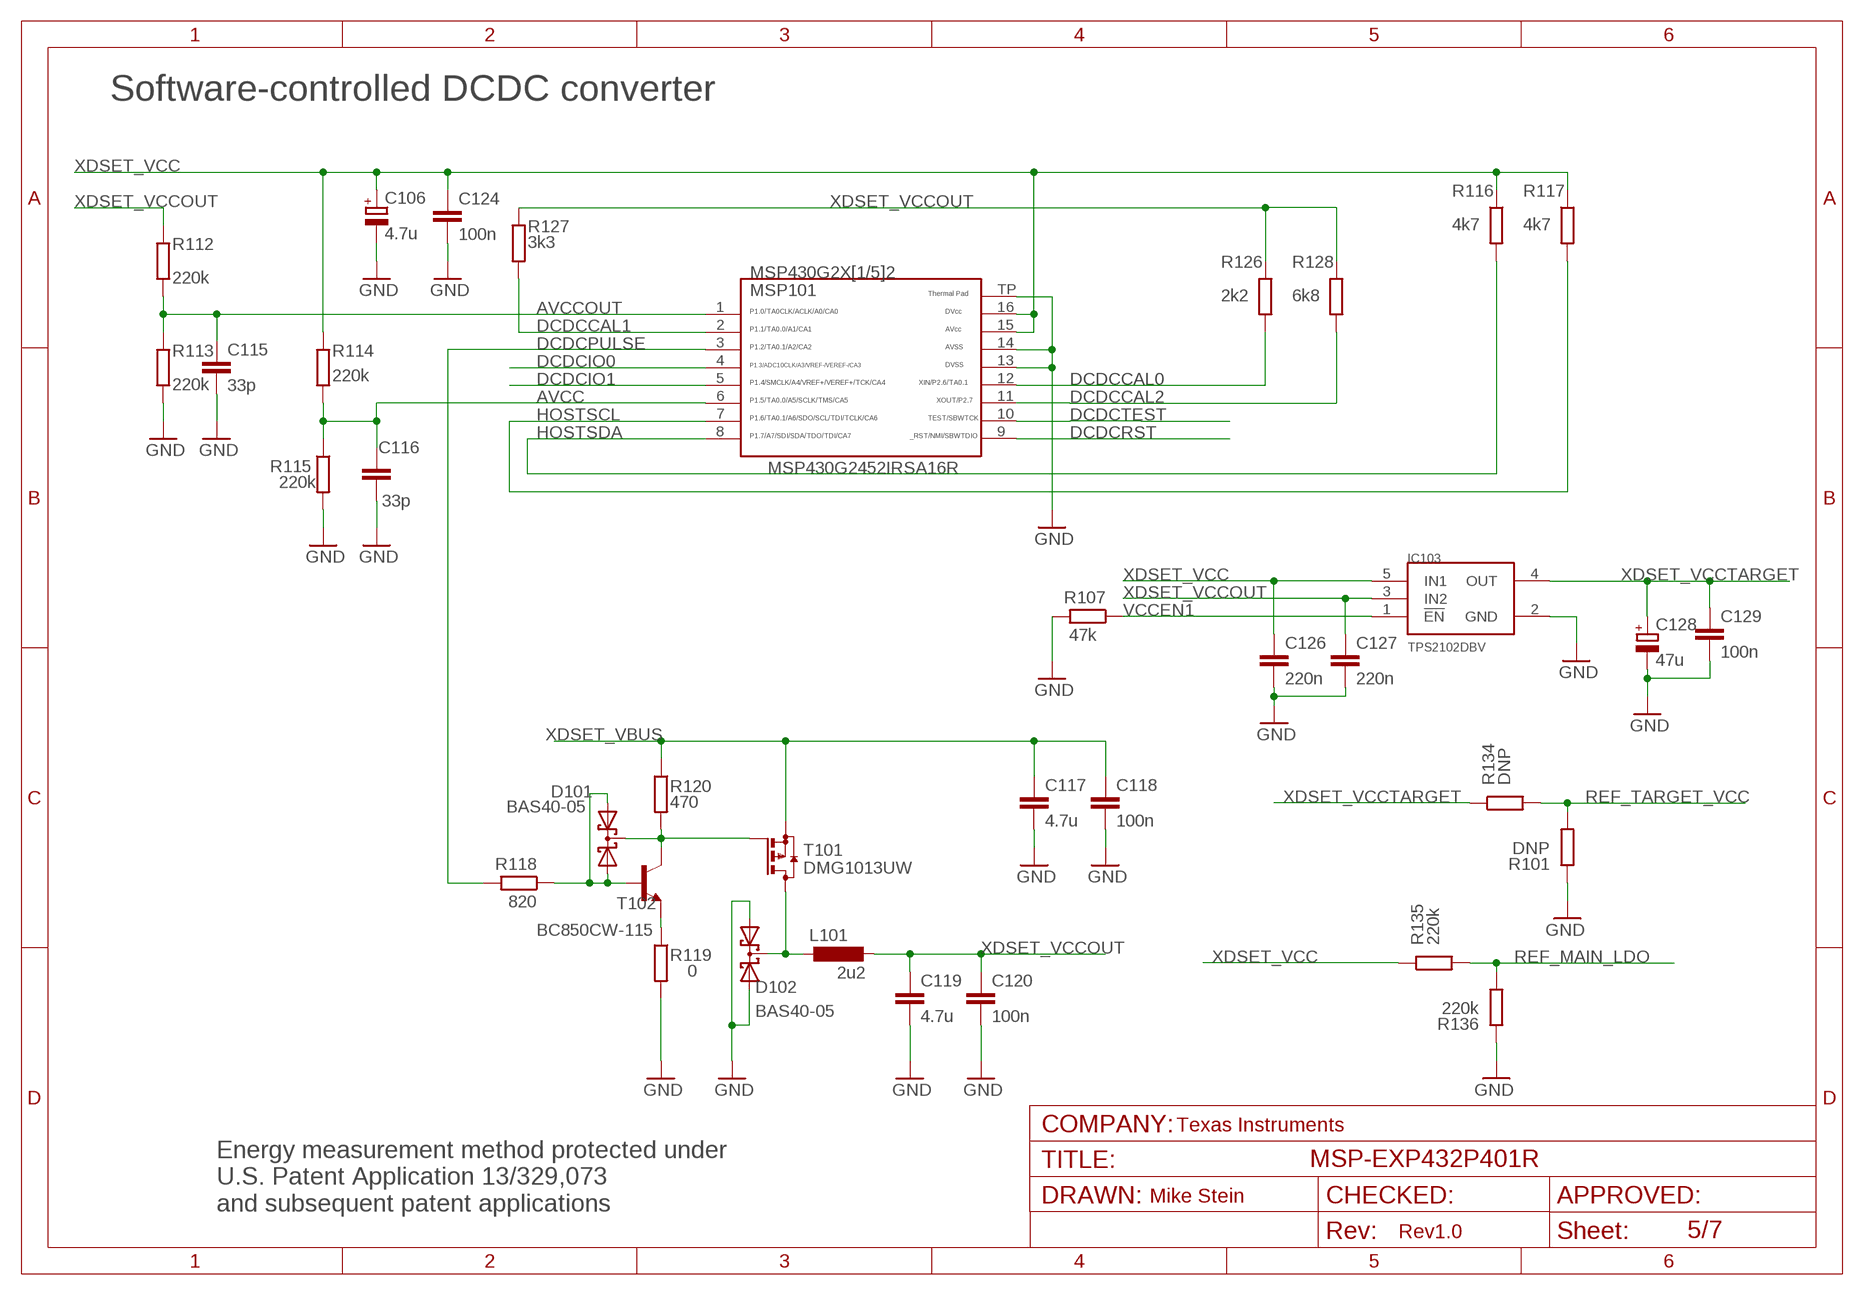
[diagram p4: schematic, sheet 5]

### Parts
C106  4.7u  CPOL-EUA/3216-18R  [A/3216-18R]
C115  33p  C-EUCM0402  [0402]
C116  33p  C-EUCM0402  [0402]
C117  4.7u  C-EUC0603  [C0603]
C118  100n  C-EUCM0402  [0402]
C119  4.7u  C-EUC0603  [C0603]
C120  100n  C-EUCM0402  [0402]
C124  100n  C-EUCM0402  [0402]
C126  220n  C-EUCM0402  [0402]
C127  220n  C-EUCM0402  [0402]
C128  47u  CPOL-EUA/3216-18R  [A/3216-18R]
C129  100n  C-EUCM0402  [0402]
D101  BAS40-05  BAS70-05  [SOT23]
D102  BAS40-05  BAS70-05  [SOT23]
IC103  TPS2102DBV  [SOT23-5]
L101  2u2  L-EUL3216C  [L3216C]
MSP101  MSP430G2452IRSA16R  G2X[1/5]2---RSA16  [RSA16]
R101  DNP  R-EU_RM0402  [0402]
R107  47k  R-EU_RM0402  [0402]
R112  220k  R-EU_RM0402  [0402]
R113  220k  R-EU_RM0402  [0402]
R114  220k  R-EU_RM0402  [0402]
R115  220k  R-EU_RM0402  [0402]
R116  4k7  R-EU_RM0402  [0402]
R117  4k7  R-EU_RM0402  [0402]
R118  820  R-EU_RM0402  [0402]
R119  0  R-EU_RM0402  [0402]
R120  470  R-EU_RM0402  [0402]
R126  2k2  R-EU_RM0402  [0402]
R127  3k3  R-EU_RM0402  [0402]
R128  6k8  R-EU_RM0402  [0402]
R134  DNP  R-EU_RM0402  [0402]
R135  220k  R-EU_RM0402  [0402]
R136  220k  R-EU_RM0402  [0402]
T101  DMG1013UW  BSS84  [SOT23]
T102  BC850CW-115  BC850SMD  [SOT23-BEC]

### Nets
AVCC: C116.2 MSP101.6 R114.2 R115.1
AVCCOUT: C115.2 MSP101.1 R112.2 R113.1
DCDCCAL0: MSP101.12 R126.2
DCDCCAL1: MSP101.2 R127.2
DCDCCAL2: MSP101.11 R128.2
DCDCIO0: MSP101.4 ; also sheet 4
DCDCIO1: MSP101.5 ; also sheet 4
DCDCPULSE: MSP101.3 R118.2 ; also sheet 4
DCDCRST: MSP101.9 ; also sheet 4,6
DCDCTEST: MSP101.10 ; also sheet 4,6
GND: C106.- C115.1 C116.1 C117.2 C118.2 C119.2 C120.2 C124.2 C126.2 C127.2 C128.- C129.2 D102.1(A1) D102.2(A2) IC103.2(GND) MSP101.13 MSP101.14 MSP101.TP R101.1 R107.2 R113.2 R115.2 R119.2 R136.1 ; also sheet 1,2,3,4,6,7
HOSTSCL: MSP101.7 R117.2 ; also sheet 4
HOSTSDA: MSP101.8 R116.2 ; also sheet 4
N$12: R119.1 T102.E
N$13: D101.1(A1) D101.2(A2) R118.1 T102.B
N$15: D102.3(C) L101.1 T101.3(D)
N$16: D101.3(C) R120.2 T101.1(G) T102.C
REF_MAIN_LDO: R135.2 R136.2 ; also sheet 4
REF_TARGET_VCC: R101.2 R134.2 ; also sheet 4
VCCEN1: IC103.1(!EN) R107.1 ; also sheet 4
XDSET_VBUS: C117.1 C118.1 R120.1 T101.2(S) ; also sheet 3,4,6
XDSET_VCC: C106.+ C124.1 C126.1 IC103.5(IN1) MSP101.15 MSP101.16 R114.1 R116.1 R117.1 R135.1 ; also sheet 4,6,7
XDSET_VCCOUT: C119.1 C120.1 C127.1 IC103.3(IN2) L101.2 R112.1 R126.1 R127.1 R128.1
XDSET_VCCTARGET: C128.+ C129.1 IC103.4(OUT) R134.1 ; also sheet 3,7

### Notes on the sheet
- Software-controlled DCDC converter
- MSP430G2452IRSA16R
- Texas Instruments
- Mike Stein
- Energy measurement method protected under 
  U.S. Patent Application 13/329,073 
  and subsequent patent applications
- Rev1.0

## Sheet 6 of 7
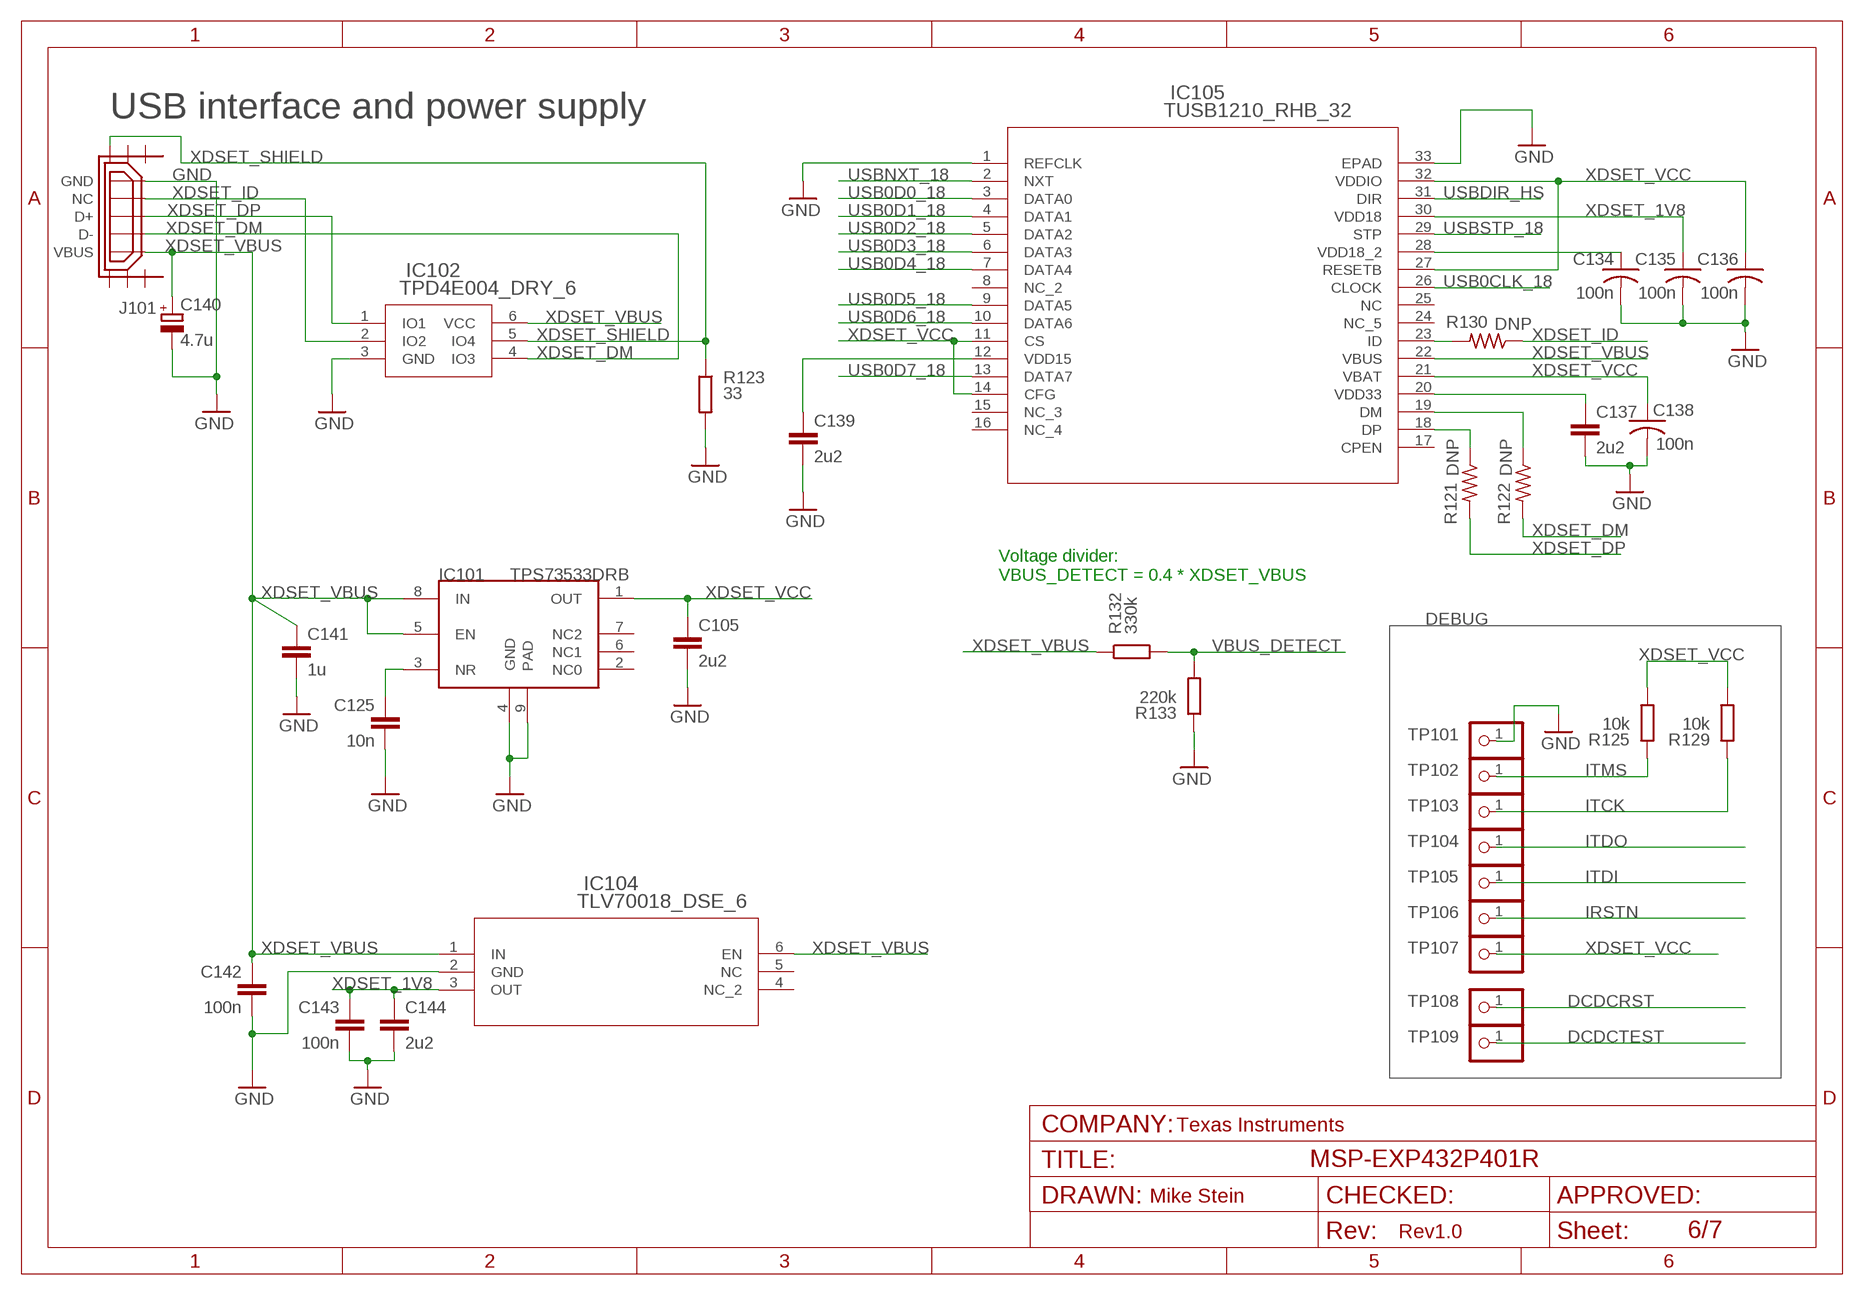
[diagram p5: schematic, sheet 6]

### Parts
C105  2u2  C-EUC0603  [C0603]
C125  10n  C-EUCM0402  [0402]
C134  100n  C-USC0402  [C0402]
C135  100n  C-USC0402  [C0402]
C136  100n  C-USC0402  [C0402]
C137  2u2  C-EUC0603  [C0603]
C138  100n  C-USC0402  [C0402]
C139  2u2  C-EUC0603  [C0603]
C140  4.7u  CPOL-EUA/3216-18R  [A/3216-18R]
C141  1u  C-EUC0603  [C0603]
C142  100n  C-EUCM0402  [0402]
C143  100n  C-EUCM0402  [0402]
C144  2u2  C-EUC0603  [C0603]
IC101  TPS73533DRB  TPS73633DRB  [SON8]
IC102  TPD4E004_DRY_6  [DRY6]
IC104  TLV70018_DSE_6  [DSE6]
IC105  TUSB1210_RHB_32  [RHB32_3P45X3P45]
J101  USB_MICRO_FLIPPED  [HIROSE-ZX62R-B-5P]
R121  DNP  R-US_R0402  [R0402]
R122  DNP  R-US_R0402  [R0402]
R123  33  R-EU_RM0402  [0402]
R125  10k  R-EU_RM0402  [0402]
R129  10k  R-EU_RM0402  [0402]
R130  DNP  R-US_R0402  [R0402]
R132  330k  R-EU_RM0402  [0402]
R133  220k  R-EU_RM0402  [0402]
TP101  TEST_PIN2  PINHD-1X1  [1X01]
TP102  TEST_PIN2  PINHD-1X1  [1X01]
TP103  TEST_PIN2  PINHD-1X1  [1X01]
TP104  TEST_PIN2  PINHD-1X1  [1X01]
TP105  TEST_PIN2  PINHD-1X1  [1X01]
TP106  TEST_PIN2  PINHD-1X1  [1X01]
TP107  TEST_PIN2  PINHD-1X1  [1X01]
TP108  TEST_PIN2  PINHD-1X1  [1X01]
TP109  TEST_PIN2  PINHD-1X1  [1X01]

### Nets
DCDCRST: TP108.1 ; also sheet 4,5
DCDCTEST: TP109.1 ; also sheet 4,5
GND: C105.2 C125.2 C134.2 C135.2 C136.2 C137.2 C138.2 C139.2 C140.- C141.2 C142.2 C143.2 C144.2 IC101.4(GND) IC101.9(PAD) IC102.3(GND) IC104.2(GND) IC105.1(REFCLK) IC105.33(EPAD) J101.GND R123.2 R133.1 TP101.1 ; also sheet 1,2,3,4,5,7
IRSTN: TP106.1 ; also sheet 4
ITCK: R129.1 TP103.1 ; also sheet 4
ITDI: TP105.1 ; also sheet 4
ITDO: TP104.1 ; also sheet 4
ITMS: R125.1 TP102.1 ; also sheet 4
N$1: IC105.18(DP) R121.1
N$2: IC105.19(DM) R122.1
N$5: C125.1 IC101.3(NR)
N$20: C137.1 IC105.20(VDD33)
N$26: C139.1 IC105.12(VDD15)
N$28: C134.1 IC105.28(VDD18_2)
USB0CLK_18: IC105.26(CLOCK) ; also sheet 7
USB0D0_18: IC105.3(DATA0) ; also sheet 7
USB0D1_18: IC105.4(DATA1) ; also sheet 7
USB0D2_18: IC105.5(DATA2) ; also sheet 7
USB0D3_18: IC105.6(DATA3) ; also sheet 7
USB0D4_18: IC105.7(DATA4) ; also sheet 7
USB0D5_18: IC105.9(DATA5) ; also sheet 7
USB0D6_18: IC105.10(DATA6) ; also sheet 7
USB0D7_18: IC105.13(DATA7) ; also sheet 7
USBDIR_HS: IC105.31(DIR) ; also sheet 7
USBNXT_18: IC105.2(NXT) ; also sheet 7
USBSTP_18: IC105.29(STP) ; also sheet 7
VBUS_DETECT: R132.2 R133.2 ; also sheet 4
XDSET_1V8: C135.1 C143.1 C144.1 IC104.3(OUT) IC105.30(VDD18) ; also sheet 7
XDSET_DM: IC102.4(IO3) J101.D- R122.2 ; also sheet 4
XDSET_DP: IC102.1(IO1) J101.D+ R121.2 ; also sheet 4
XDSET_ID: IC102.2(IO2) J101.NC R130.1 ; also sheet 4
XDSET_IDR: IC105.23(ID) R130.2
XDSET_SHIELD: IC102.5(IO4) J101.SHIELD3 R123.1
XDSET_VBUS: C140.+ C141.1 C142.1 IC101.5(EN) IC101.8(IN) IC102.6(VCC) IC104.1(IN) IC104.6(EN) IC105.22(VBUS) J101.VBUS R132.1 ; also sheet 3,4,5
XDSET_VCC: C105.1 C136.1 C138.1 IC101.1(OUT) IC105.11(CS) IC105.14(CFG) IC105.21(VBAT) IC105.27(RESETB) IC105.32(VDDIO) R125.2 R129.2 TP107.1 ; also sheet 4,5,7
Unconnected: IC101.2(NC0) IC101.6(NC1) IC101.7(NC2) IC104.4(NC_2) IC104.5(NC) IC105.8(NC_2) IC105.15(NC_3) IC105.16(NC_4) IC105.17(CPEN) IC105.24(NC_5) IC105.25(NC) J101.SHIELD1 J101.SHIELD2 J101.SHIELD4 J101.SHIELD5 J101.SHIELD6

### Notes on the sheet
- USB interface and power supply
- Voltage divider:
  VBUS_DETECT = 0.4 * XDSET_VBUS
- DEBUG
- Texas Instruments
- Mike Stein
- Rev1.0

## Sheet 7 of 7
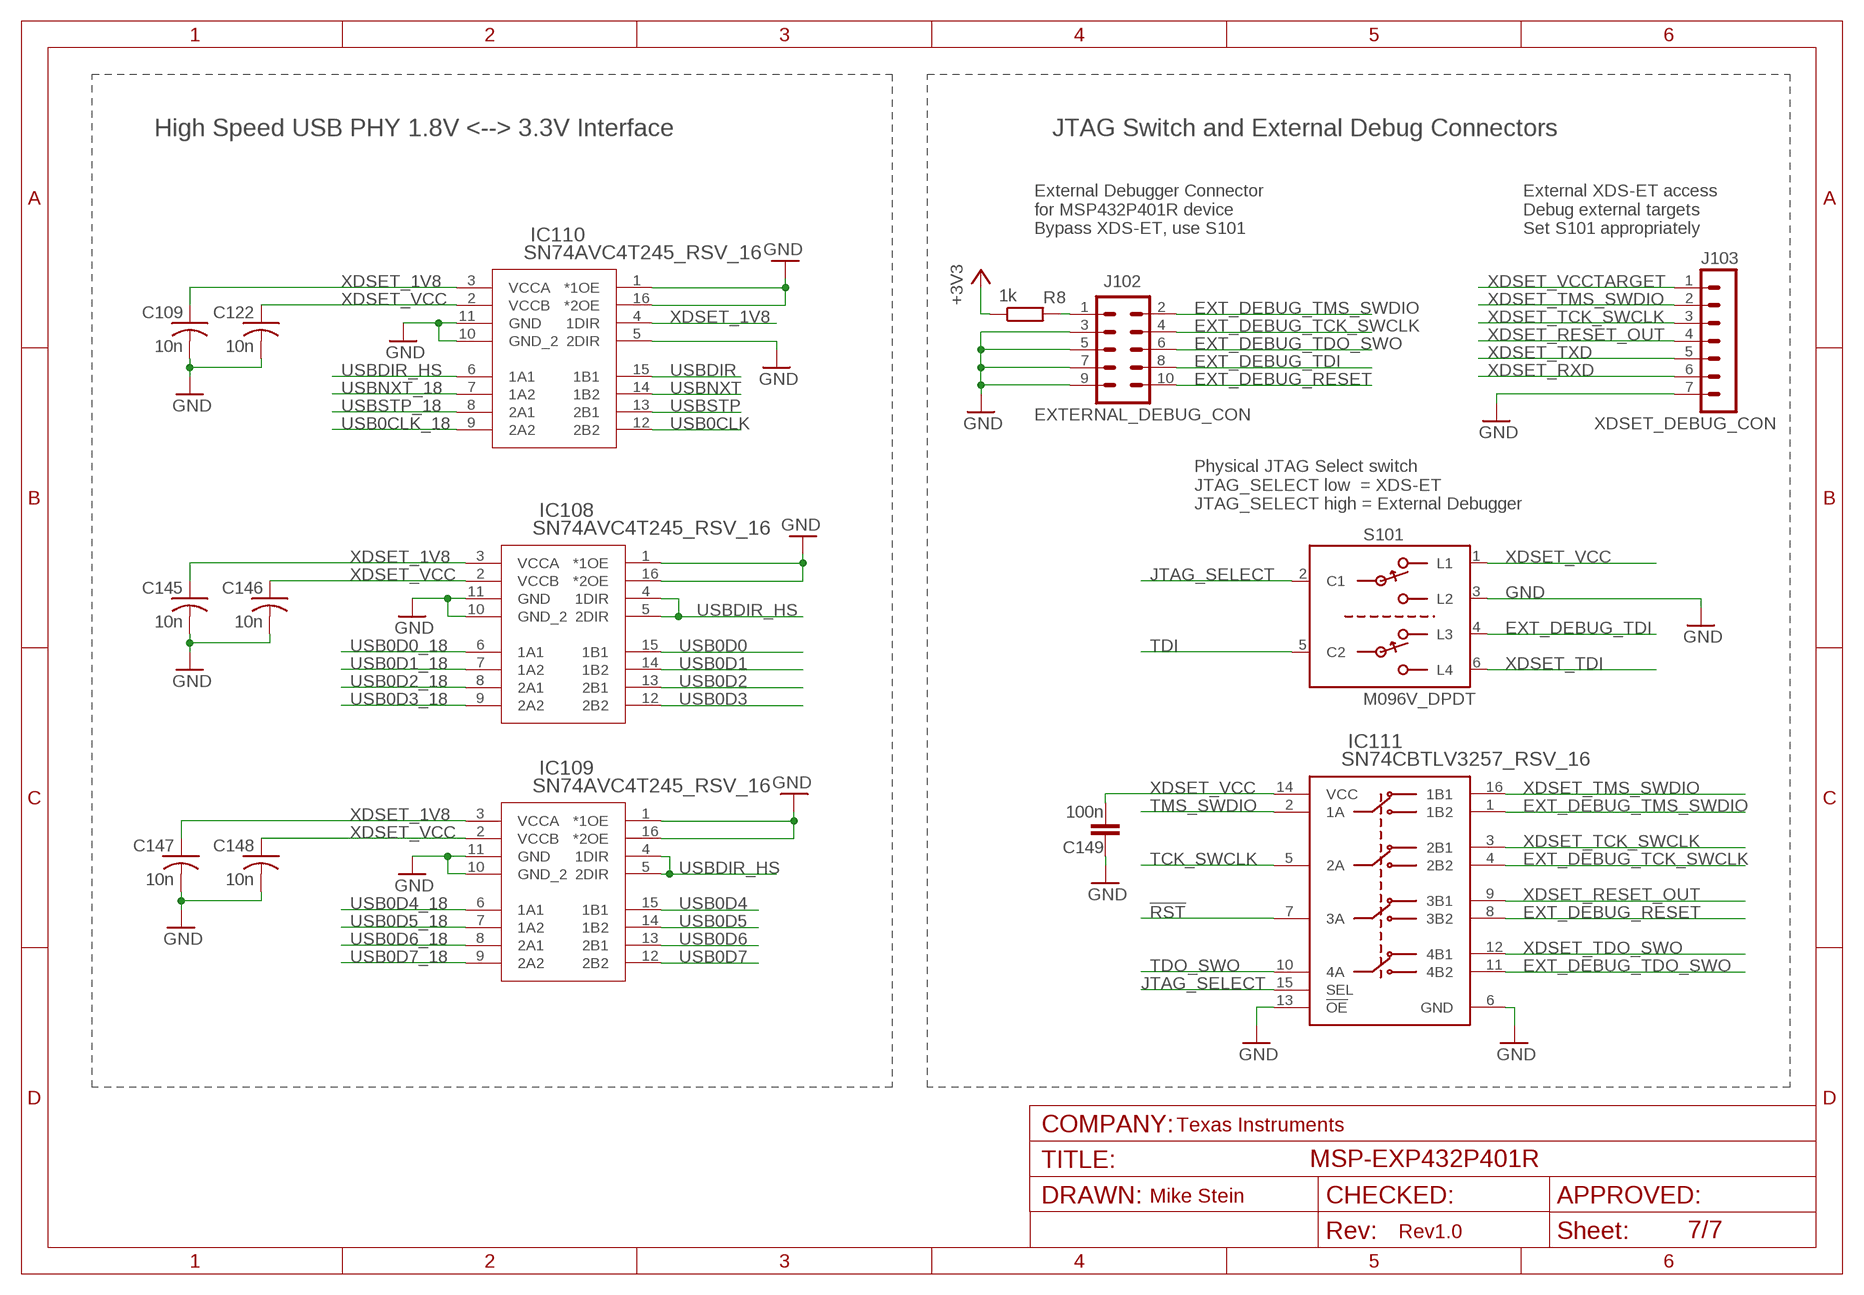
[diagram p6: schematic, sheet 7]

### Parts
C109  10n  C-USC0402  [C0402]
C122  10n  C-USC0402  [C0402]
C145  10n  C-USC0402  [C0402]
C146  10n  C-USC0402  [C0402]
C147  10n  C-USC0402  [C0402]
C148  10n  C-USC0402  [C0402]
C149  100n  C-EUCM0402  [0402]
IC108  SN74AVC4T245_RSV_16  [RSV16]
IC109  SN74AVC4T245_RSV_16  [RSV16]
IC110  SN74AVC4T245_RSV_16  [RSV16]
IC111  SN74CBTLV3257_RSV_16  [RSV16]
J102  EXTERNAL_DEBUG_CON  [EXTERNAL_DEBUG]
J103  XDSET_DEBUG_CON  [XDSET_DEBUG]
R8  1k  R-EU_RM0402  [0402]
S101  M096V_DPDT  [M096V_DPDT]

### Nets
!RST: IC111.7(3A) ; also sheet 1,2,3
+3V3: R8.1 ; also sheet 1,2,3
EXT_DEBUG_RESET: IC111.8(3B2) J102.10
EXT_DEBUG_TCK_SWCLK: IC111.4(2B2) J102.4
EXT_DEBUG_TDI: J102.8 S101.4(L3)
EXT_DEBUG_TDO_SWO: IC111.11(4B2) J102.6
EXT_DEBUG_TMS_SWDIO: IC111.1(1B2) J102.2
GND: C109.2 C122.2 C145.2 C146.2 C147.2 C148.2 C149.2 IC108.1(*1OE) IC108.10(GND_2) IC108.11(GND) IC108.16(*2OE) IC109.1(*1OE) IC109.10(GND_2) IC109.11(GND) IC109.16(*2OE) IC110.1(*1OE) IC110.5(2DIR) IC110.10(GND_2) IC110.11(GND) IC110.16(*2OE) IC111.6(GND) IC111.13(!OE) J102.3 J102.5 J102.7 J102.9 J103.7 S101.3(L2) ; also sheet 1,2,3,4,5,6
JTAG_SELECT: IC111.15(SEL) S101.2(C1)
N$14: J102.1 R8.2
TCK_SWCLK: IC111.5(2A) ; also sheet 1
TDI: S101.5(C2) ; also sheet 1
TDO_SWO: IC111.10(4A) ; also sheet 1
TMS_SWDIO: IC111.2(1A) ; also sheet 1
USB0CLK: IC110.12(2B2) ; also sheet 4
USB0CLK_18: IC110.9(2A2) ; also sheet 6
USB0D0: IC108.15(1B1) ; also sheet 4
USB0D0_18: IC108.6(1A1) ; also sheet 6
USB0D1: IC108.14(1B2) ; also sheet 4
USB0D1_18: IC108.7(1A2) ; also sheet 6
USB0D2: IC108.13(2B1) ; also sheet 4
USB0D2_18: IC108.8(2A1) ; also sheet 6
USB0D3: IC108.12(2B2) ; also sheet 4
USB0D3_18: IC108.9(2A2) ; also sheet 6
USB0D4: IC109.15(1B1) ; also sheet 4
USB0D4_18: IC109.6(1A1) ; also sheet 6
USB0D5: IC109.14(1B2) ; also sheet 4
USB0D5_18: IC109.7(1A2) ; also sheet 6
USB0D6: IC109.13(2B1) ; also sheet 4
USB0D6_18: IC109.8(2A1) ; also sheet 6
USB0D7: IC109.12(2B2) ; also sheet 4
USB0D7_18: IC109.9(2A2) ; also sheet 6
USBDIR: IC110.15(1B1) ; also sheet 4
USBDIR_HS: IC108.4(1DIR) IC108.5(2DIR) IC109.4(1DIR) IC109.5(2DIR) IC110.6(1A1) ; also sheet 6
USBNXT: IC110.14(1B2) ; also sheet 4
USBNXT_18: IC110.7(1A2) ; also sheet 6
USBSTP: IC110.13(2B1) ; also sheet 4
USBSTP_18: IC110.8(2A1) ; also sheet 6
XDSET_1V8: C109.1 C145.1 C147.1 IC108.3(VCCA) IC109.3(VCCA) IC110.3(VCCA) IC110.4(1DIR) ; also sheet 6
XDSET_RESET_OUT: IC111.9(3B1) J103.4 ; also sheet 4
XDSET_RXD: J103.6 ; also sheet 3,4
XDSET_TCK_SWCLK: IC111.3(2B1) J103.3 ; also sheet 4
XDSET_TDI: S101.6(L4) ; also sheet 4
XDSET_TDO_SWO: IC111.12(4B1) ; also sheet 4
XDSET_TMS_SWDIO: IC111.16(1B1) J103.2 ; also sheet 4
XDSET_TXD: J103.5 ; also sheet 3,4
XDSET_VCC: C122.1 C146.1 C148.1 C149.1 IC108.2(VCCB) IC109.2(VCCB) IC110.2(VCCB) IC111.14(VCC) S101.1(L1) ; also sheet 4,5,6
XDSET_VCCTARGET: J103.1 ; also sheet 3,5

### Notes on the sheet
- High Speed USB PHY 1.8V <--> 3.3V Interface | JTAG Switch and External Debug Connectors
- External Debugger Connector
  for MSP432P401R device
  Bypass XDS-ET, use S101
- External XDS-ET access
  Debug external targets
  Set S101 appropriately
- Physical JTAG Select switch
  JTAG_SELECT low  = XDS-ET
  JTAG_SELECT high = External Debugger
- Texas Instruments
- Mike Stein
- Rev1.0

## Library data of the parts
C1 C2 C4-C9 C11-C14 C105 C107 C115-C120 C124-C127 C129 C130 C132 C137 C139 C141-C144 C149 = rcl:C-EU: CAPACITOR, European symbol
C3 C106 C128 C140 = rcl:CPOL-EU: POLARIZED CAPACITOR, European symbol
C10 = cap:CSMD0805
C101 C102 = EK-TM4C129EXL:C-US: CAPACITOR, American symbol; GNUM: G10-C0402-C120-AAC
C103 C104 C108-C114 C121-C123 C131 C134-C136 C138 C145-C148 = EK-TM4C129EXL:C-US: CAPACITOR, American symbol; GNUM: G10-C0402-C104-HBA
C133 = EK-TM4C129EXL:C-US: CAPACITOR, American symbol; DIGIKEY_PARTNUM: 311-1451-2-ND; GNUM: G10-C0603-C225-HBB
D101 D102 = diode:BAS70-05: Silicon Schottky Diodes General-purpose diode for high-speed switching
IC101 = MSP430G6_LP:TPS73633DRB
IC102 = MSP-EXP432:TPD4E004_DRY_6; DATASHEETURL: http://www.ti.com/lit/gpn/TPD4E004; DESCRIPTION: 4-Channel ESD Protection Array for High-Speed Data Interfaces; FAMILY_NAME: ESD Solution; GENERIC_PART_NUMBER: TPD4E004; INDUSTRY_STD_PKG_TYPE: SON; MANUFACTURER: Texas Instruments; MANUFACTURER_PART_NUMBER: tpd4e004_dry_6; PACKAGE_DESIGNATOR: DRY; PIN_COUNT: 6; VENDOR: Texas Instruments
IC103 = MSP430G6_LP:TPS2102DBV
IC104 = MSP-EXP432:TLV70018_DSE_6; DATASHEETURL: http://www.ti.com/lit/gpn/TLV70018; DESCRIPTION: 200mA, Low IQ, Low Dropout Regulator for Portables; FAMILY_NAME: SINGLE CHANNEL LDO; GENERIC_PART_NUMBER: TLV70018; INDUSTRY_STD_PKG_TYPE: WSON; MANUFACTURER: Texas Instruments; MANUFACTURER_PART_NUMBER: tlv70018_dse_6; PACKAGE_DESIGNATOR: DSE; PIN_COUNT: 6; VENDOR: Texas Instruments
IC105 = MSP-EXP432:TUSB1210_RHB_32; DATASHEETURL: http://www.ti.com/lit/gpn/TUSB1210; DESCRIPTION: USB 2.0 ULPI Transceiver; FAMILY_NAME: USB TRANSCEIVER; GENERIC_PART_NUMBER: TUSB1210; INDUSTRY_STD_PKG_TYPE: QFN; MANUFACTURER: Texas Instruments; MANUFACTURER_PART_NUMBER: tusb1210_rhb_32; PACKAGE_DESIGNATOR: RHB; PIN_COUNT: 32; VENDOR: Texas Instruments
IC106 = EK-TM4C129EXL:TM4C129ENCPDT
IC107 = MSP-EXP432:LM4040B25_DCK_5; DATASHEETURL: http://www.ti.com/lit/gpn/LM4040B25; DESCRIPTION: 2.5-V Precision Micropower Shunt Voltage Reference, 0.2% accuracy; FAMILY_NAME: SHUNT VOLTAGE REFERENCE; GENERIC_PART_NUMBER: LM4040B25; INDUSTRY_STD_PKG_TYPE: SC70; MANUFACTURER: Texas Instruments; MANUFACTURER_PART_NUMBER: lm4040b25_dck_5; PACKAGE_DESIGNATOR: DCK; PIN_COUNT: 5; VENDOR: Texas Instruments
IC108-IC110 = MSP-EXP432:SN74AVC4T245_RSV_16; DATASHEETURL: http://www.ti.com/lit/gpn/SN74AVC4T245; DESCRIPTION: 4-Bit Dual-Supply Bus Transceiver with Configurable Voltage Translation and 3-State Outputs; FAMILY_NAME: DIRECTION CONTROL DUAL SUPPLY TRANSLATOR; GENERIC_PART_NUMBER: SN74AVC4T245; INDUSTRY_STD_PKG_TYPE: UQFN; MANUFACTURER: Texas Instruments; MANUFACTURER_PART_NUMBER: sn74avc4t245_rsv_16; PACKAGE_DESIGNATOR: RSV; PIN_COUNT: 16; VENDOR: Texas Instruments
IC111 = MSP-EXP432:SN74CBTLV3257_RSV_16
J1 = circuitco-eagle:HEADER1X10
J2 = circuitco-eagle:HEADER1X10-J2
J3 = circuitco-eagle:HEADER1X10-J3
J4 = circuitco-eagle:HEADER1X10-J4
J5 = MSP-EXP432:EDGE_CON
J6 J7 = MSP-EXP432:JP3
J101 = usb_con-update:USB_MICRO_FLIPPED
J102 = MSP-EXP432:EXTERNAL_DEBUG_CON
J103 = MSP-EXP432:XDSET_DEBUG_CON
JP2 JP3 JP4.1-JP4.4 JP8-JP11 = jumper:JP1M
L1 = Murata:LQM2MP_G0
L101 = rcl:L-EU: INDUCTOR, European symbol
LED1 LED101 LED102 = led:LED: LED OSRAM: - CHIPLED LG R971, LG N971, LY N971, LG Q971, LY Q971, LO R971, LY R971 LH N974, LH R974 LS Q976, LO Q976, LY Q976 LO Q996 - Hyper CHIPLED LW Q18S LB Q993, LB Q99A, LB R99A - SideLED LS A670, LO A670, LY A670, LG A670, LP A670 LB A673, LV A673, LT A673, LW A673 LH A674 LY A675 LS A676, LA A676, LO A676, LY A676, LW A676 LS A679, LY A679, LG A679 - Hyper Micro SIDELED® LS Y876, LA Y876, LO Y876, LY Y876 LT Y87S - SmartLED LW L88C, LW L88S LB L89C, LB L89S, LG L890 LS L89K, LO L89K, LY L89K LS L896, LA L896, LO L896, LY L896 - TOPLED LS T670, LO T670, LY T670, LG T670, LP T670 LSG T670, LSP T670, LSY T670, LOP T670, LYG T670 LG T671, LOG T671, LSG T671 LB T673, LV T673, LT T673, LW T673 LH T674 LS T676, LA T676, LO T676, LY T676, LB T676, LH T676, LSB T676, LW T676 LB T67C, LV T67C, LT T67C, LS T67K, LO T67K, LY T67K, LW E67C LS E67B, LA E67B, LO E67B, LY E67B, LB E67C, LV E67C, LT E67C LW T67C LS T679, LY T679, LG T679 LS T770, LO T770, LY T770, LG T770, LP T770 LB T773, LV T773, LT T773, LW T773 LH T774 LS E675, LA E675, LY E675, LS T675 LS T776, LA T776, LO T776, LY T776, LB T776 LHGB T686 LT T68C, LB T68C - Hyper Mini TOPLED® LB M676 - Mini TOPLED Santana® LG M470 LS M47K, LO M47K, LY M47K Source: http://www.osram.convergy.de LUXEON: - LUMILED® LXK2-PW12-R00, LXK2-PW12-S00, LXK2-PW14-U00, LXK2-PW14-V00 LXK2-PM12-R00, LXK2-PM12-S00, LXK2-PM14-U00 LXK2-PE12-Q00, LXK2-PE12-R00, LXK2-PE12-S00, LXK2-PE14-T00, LXK2-PE14-U00 LXK2-PB12-K00, LXK2-PB12-L00, LXK2-PB12-M00, LXK2-PB14-N00, LXK2-PB14-P00, LXK2-PB14-Q00 LXK2-PR12-L00, LXK2-PR12-M00, LXK2-PR14-Q00, LXK2-PR14-R00 LXK2-PD12-Q00, LXK2-PD12-R00, LXK2-PD12-S00 LXK2-PH12-R00, LXK2-PH12-S00 LXK2-PL12-P00, LXK2-PL12-Q00, LXK2-PL12-R00 Source: www.luxeon.com KINGBRIGHT: KA-3528ASYC Source: www.kingbright.com
LED2 = MSP-EXP432:EVERLIGHT_19-337
MSP1 = MSP-EXP432:MSP432
MSP101 = TI_MSP430_v16:G2X[1/5]2---RSA16: MSP430G2X[1/5]2 MSP430G2x52, MSP430G2x12 QFN (RSA) 16 Pin Package http://focus.ti.com/docs/prod/folders/print/msp430g2452.html
Q1 = microcrystal:MS3V-T1R
Q2 = Geyer:KX-7
Q101 = MSP-EXP432:NX3225GA_OSC
R1-R4 R6-R8 R101 R107 R111-R120 R123-R129 R132-R136 = rcl:R-EU_: RESISTOR, European symbol
R5 = smd:R_0805
R102 R108-R110 = EK-TM4C129EXL:R-US_: RESISTOR, American symbol; GNUM: G11-R0402-1000-AAA
R103 = EK-TM4C129EXL:R-US_: RESISTOR, American symbol; GNUM: G11-R0402-1002-AAA
R104 R105 R121 R122 R130 R131 R137 R138 = EK-TM4C129EXL:R-US_: RESISTOR, American symbol; GNUM: G11-R0402-51R0-AAA
R106 R139 = EK-TM4C129EXL:R-US_: RESISTOR, American symbol; GNUM: G11-R0402-R202-AAA
S1-S3 = electricalmeter:PB: OMRON SWITCH
S101 = MSP430_SwitchesTestpointsJumpers:M096V_DPDT
T101 = transistor-small-signal:BSS84: P-CHANNEL MOS FET
T102 = transistor-npn:BC850*: NPN Transistor
TP101-TP110 = pinhead:PINHD-1X1: PIN HEADER
U$1-U$3 U$5 = MSP-EXP432:MOUNTHOLE_125MIL
U$6 = MSP-EXP432:SILK_HEADER_LABEL
U$7 = MSP-EXP432:SILK_3V3_TAG
U$8 = MSP-EXP432:SILK_P401R_REAR

## Net classes
0 default: width 0.254 mm
1 Ground: width 0.203 mm, drill 0.305 mm, clearance 0.152 mm to class 0, clearance 0.152 mm
2 Power: width 0.203 mm, drill 0.305 mm, clearance 0.152 mm to class 0, clearance 0.152 mm to class 1, clearance 0.152 mm